# EAGLE design EPS (EAGLE 7.7.0)

## Sheet 1 of 3
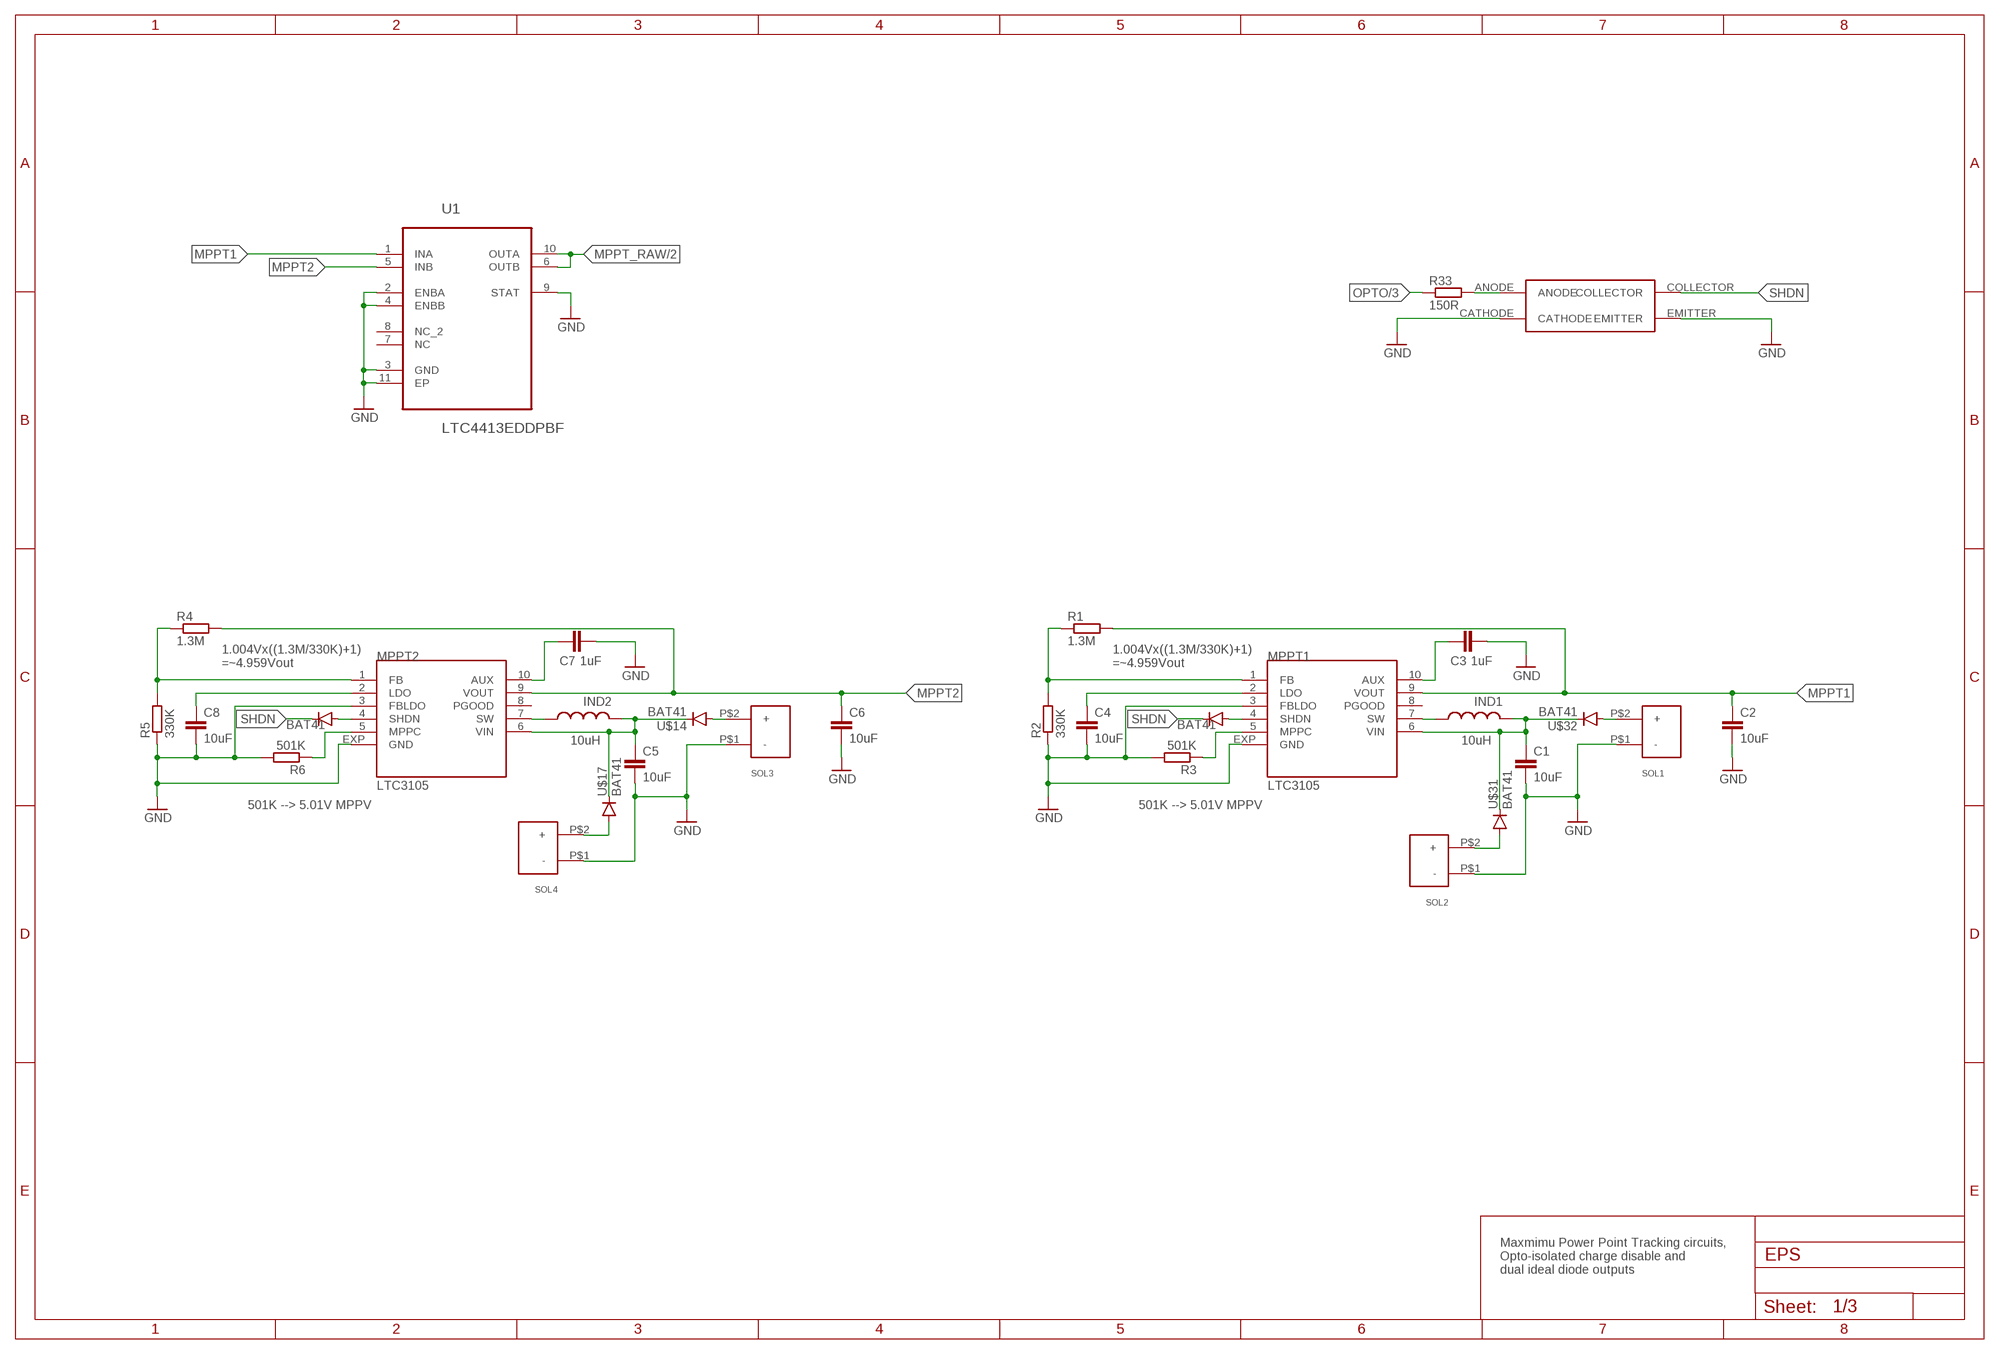
[diagram p0: schematic, sheet 1]

### Parts
C1  10uF  C-EUC0603  [C0603]
C2  10uF  C-EUC0603  [C0603]
C3  1uF  C-EUC0402  [C0402]
C4  10uF  C-EUC0603  [C0603]
C5  10uF  C-EUC0603  [C0603]
C6  10uF  C-EUC0603  [C0603]
C7  1uF  C-EUC0402  [C0402]
C8  10uF  C-EUC0603  [C0603]
IND1  WE-TPC-744031100  [WE-TPC-744031100]
IND2  WE-TPC-744031100  [WE-TPC-744031100]
MPPT1  LTC3105  [DFN-3X3]
MPPT2  LTC3105  [DFN-3X3]
R1  1.3M  R-EU_R0402  [R0402]
R2  330K  R-EU_R0402  [R0402]
R3  501K  R-EU_R0402  [R0402]
R4  1.3M  R-EU_R0402  [R0402]
R5  330K  R-EU_R0402  [R0402]
R6  501K  R-EU_R0402  [R0402]
R33  150R  R-EU_R0402  [R0402]
SOL1  JST-B2B-ZH  [JST-B2B-ZR]
SOL2  JST-B2B-ZH  [JST-B2B-ZR]
SOL3  JST-B2B-ZH  [JST-B2B-ZR]
SOL4  JST-B2B-ZH  [JST-B2B-ZR]
U1  LTC4413EDDPBF  [DFN300X300X80-11N]
U$4  BAT41  [SOD-123]
U$10  BAT41  [SOD-123]
U$14  BAT41  [SOD-123]
U$17  BAT41  [SOD-123]
U$24  EL3H7  [EL3H7]
U$31  BAT41  [SOD-123]
U$32  BAT41  [SOD-123]

### Nets
GND: C1.2 C2.2 C3.2 C4.2 C5.2 C6.2 C7.2 C8.2 MPPT1.3(FBLDO) MPPT1.EXP(GND) MPPT2.3(FBLDO) MPPT2.EXP(GND) R2.1 R3.2 R5.1 R6.2 SOL1.P$1(-) SOL2.P$1(-) SOL3.P$1(-) SOL4.P$1(-) U1.2(ENBA) U1.3(GND) U1.4(ENBB) U1.9(STAT) U1.11(EP) U$24.CATHODE U$24.EMITTER ; also sheet 2,3
MPPT1: C2.1 MPPT1.9(VOUT) R1.2 U1.1(INA)
MPPT2: C6.1 MPPT2.9(VOUT) R4.2 U1.5(INB)
MPPT_RAW: U1.6(OUTB) U1.10(OUTA) ; also sheet 2,3
N$1: IND1.P$1 MPPT1.7(SW)
N$2: C1.1 IND1.P$3 MPPT1.6(VIN) U$31.P$1(C) U$32.P$1(C)
N$3: IND2.P$1 MPPT2.7(SW)
N$4: C3.1 MPPT1.10(AUX)
N$5: C7.1 MPPT2.10(AUX)
N$6: C5.1 IND2.P$3 MPPT2.6(VIN) U$14.P$1(C) U$17.P$1(C)
N$7: MPPT2.1(FB) R4.1 R5.2
N$8: C4.1 MPPT1.2(LDO)
N$9: MPPT1.1(FB) R1.1 R2.2
N$10: MPPT2.5(MPPC) R6.1
N$11: C8.1 MPPT2.2(LDO)
N$12: MPPT2.4(SHDN) U$10.P$2(A)
N$13: SOL4.P$2(+) U$17.P$2(A)
N$14: MPPT1.4(SHDN) U$4.P$2(A)
N$15: MPPT1.5(MPPC) R3.1
N$16: SOL3.P$2(+) U$14.P$2(A)
N$17: SOL2.P$2(+) U$31.P$2(A)
N$18: SOL1.P$2(+) U$32.P$2(A)
N$33: R33.2 U$24.ANODE
OPTO: R33.1 ; also sheet 3
SHDN: U$4.P$1(C) U$10.P$1(C) U$24.COLLECTOR
Unconnected: MPPT1.8(PGOOD) MPPT2.8(PGOOD) U1.7(NC) U1.8(NC_2)

### Notes on the sheet
- 1.004Vx((1.3M/330K)+1)
  =~4.959Vout
- 1.004Vx((1.3M/330K)+1)
  =~4.959Vout
- 10uH | 10uH
- 501K --> 5.01V MPPV | 501K --> 5.01V MPPV
- Maxmimu Power Point Tracking circuits,
  Opto-isolated charge disable and
  dual ideal diode outputs

## Sheet 2 of 3
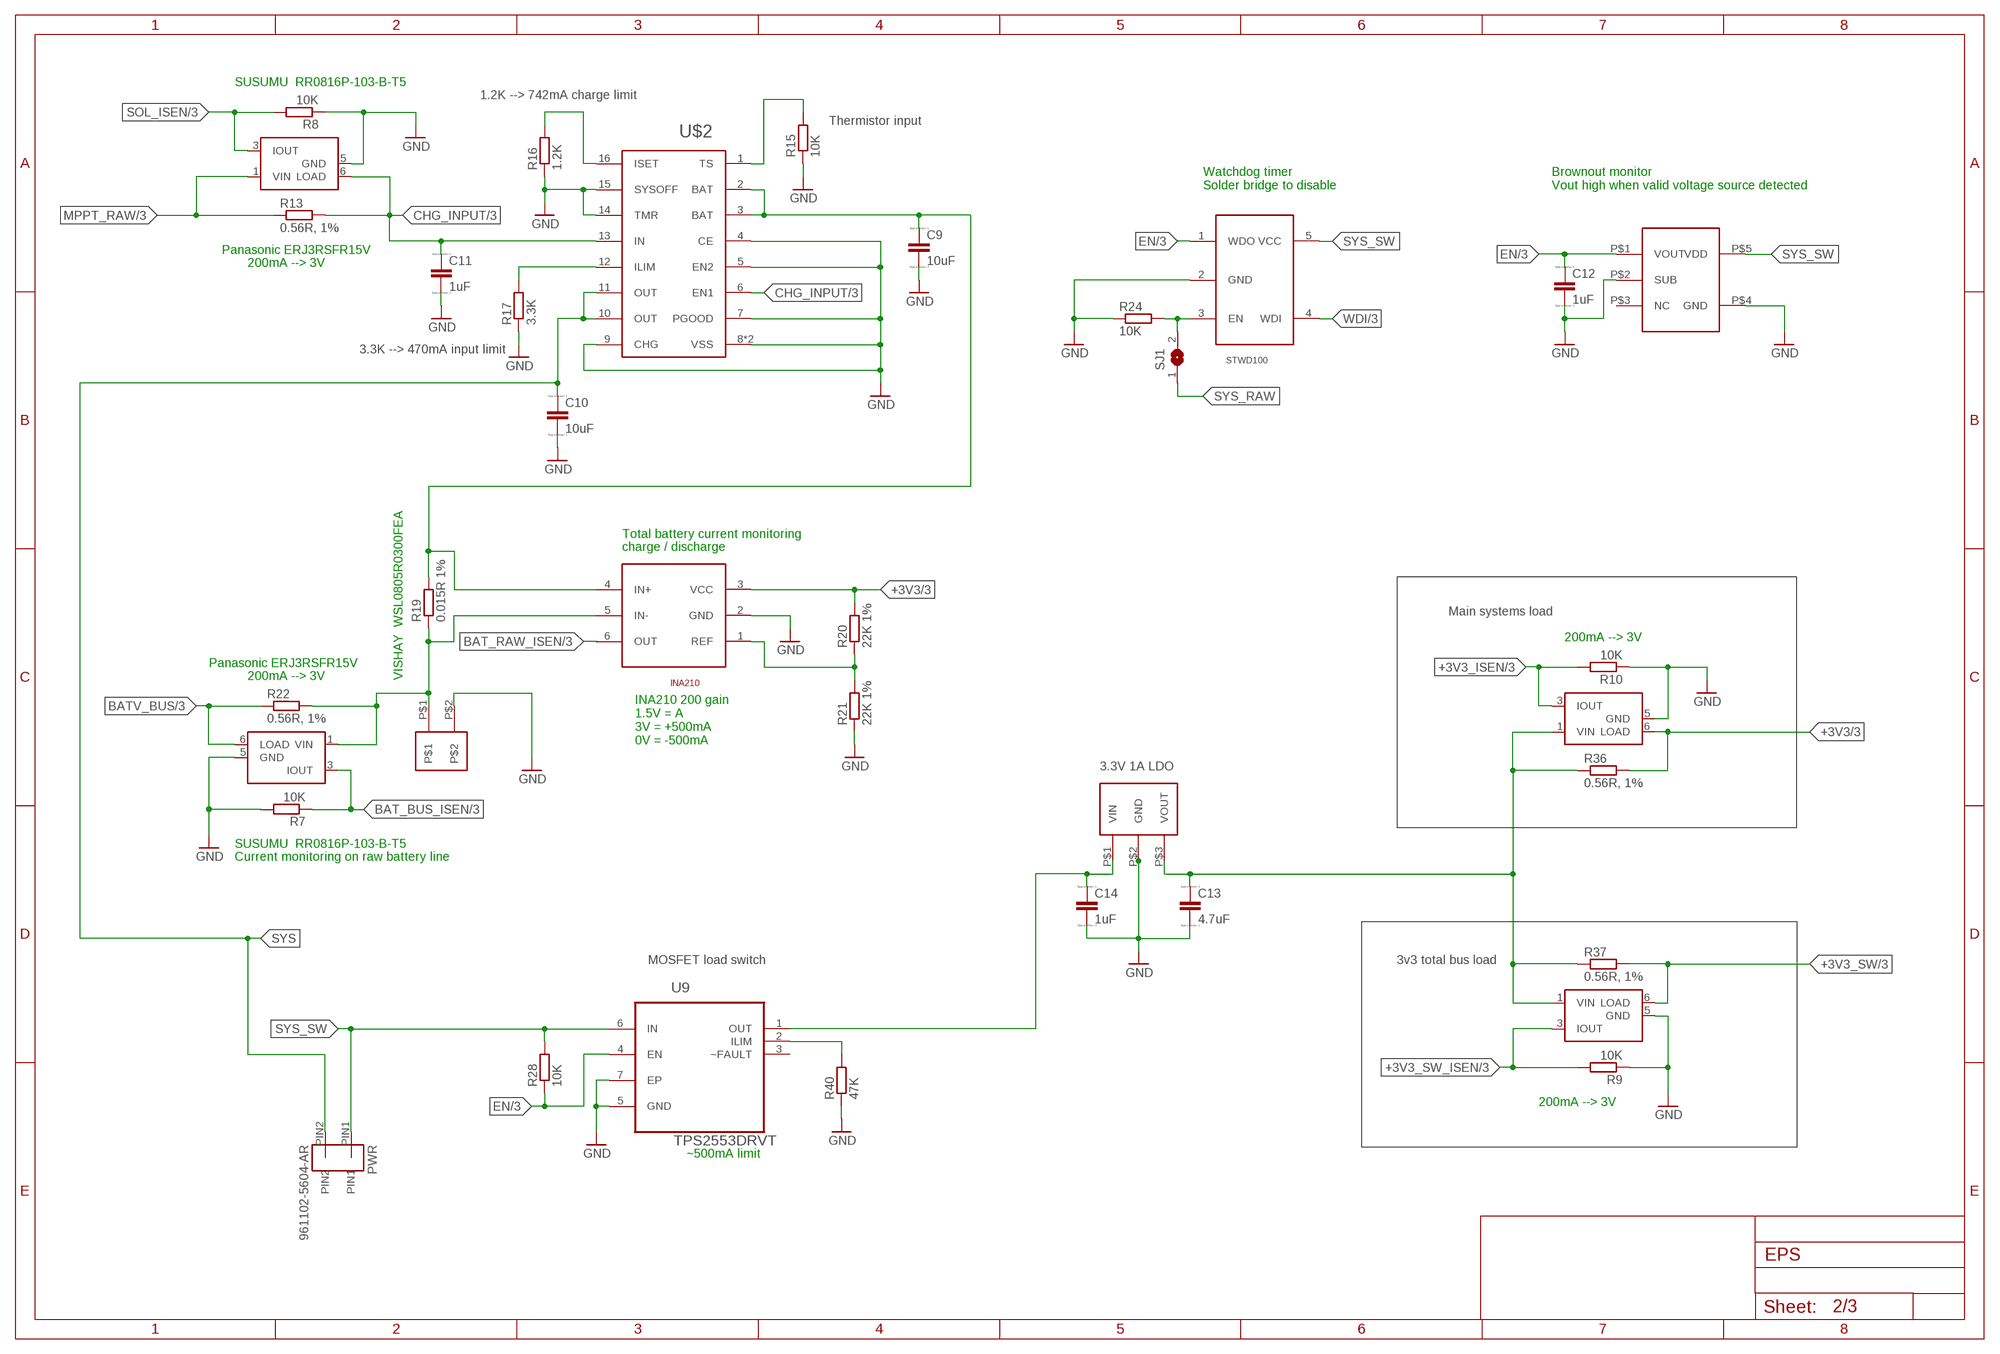
[diagram p1: schematic, sheet 2]

### Parts
C9  10uF  C-EUC0805  [C0805]
C10  10uF  C-EUC0805  [C0805]
C11  1uF  C-EUC0603  [C0603]
C12  1uF  C-EUC0603  [C0603]
C13  4.7uF  C-EUC0805  [C0805]
C14  1uF  C-EUC0603  [C0603]
INA210  INA211A  [SC-70]
PWR  961102-5604-AR  [961102-5604-AR]
R7  10K  R-EU_R0402  [R0402]
R8  10K  R-EU_R0402  [R0402]
R9  10K  R-EU_R0402  [R0402]
R10  10K  R-EU_R0402  [R0402]
R13  0.56R, 1%  R-EU_R0603  [R0603]
R15  10K  R-EU_R0402  [R0402]
R16  1.2K  R-EU_R0402  [R0402]
R17  3.3K  R-EU_R0402  [R0402]
R19  0.015R 1%  R-EU_R0603  [R0603]
R20  22K 1%  R-EU_R0402  [R0402]
R21  22K 1%  R-EU_R0402  [R0402]
R22  0.56R, 1%  R-EU_R0603  [R0603]
R24  10K  R-EU_R0402  [R0402]
R28  10K  R-EU_R0402  [R0402]
R36  0.56R, 1%  R-EU_R0603  [R0603]
R37  0.56R, 1%  R-EU_R0603  [R0603]
R40  47K  R-EU_R0402  [R0402]
SJ1  SJ  [SJ]
STWD100  STWD100PYW83F  [SOT_323-5]
U9  TPS2553DRVT  [SON65P200X200X80-7N]
U$2  BQ24079  [PVQFN16-THERM]
U$3  PICOBLADE53047  [PICOBLADE53047]
U$18  FAN4010IL6X_F113  [FAN4010IL6X_F113]
U$19  FAN4010IL6X_F113  [FAN4010IL6X_F113]
U$20  MCP1826S  [SOT223-3]
U$25  FAN4010IL6X_F113  [FAN4010IL6X_F113]
U$26  FAN4010IL6X_F113  [FAN4010IL6X_F113]
U$29  BD4835FVE  [VSOF5]

### Nets
+3V3: INA210.3(VCC) R20.2 R36.2 U$25.6(LOAD) ; also sheet 3
+3V3_ISEN: R10.2 U$25.3(IOUT) ; also sheet 3
+3V3_REG: C13.1 R36.1 R37.1 U$20.P$3(VOUT) U$25.1(VIN) U$26.1(VIN)
+3V3_SW: R37.2 U$26.6(LOAD) ; also sheet 3
+3V3_SW_ISEN: R9.2 U$26.3(IOUT) ; also sheet 3
BAT_BUS_ISEN: R7.1 U$19.3(IOUT) ; also sheet 3
BAT_RAW_ISEN: INA210.6(OUT) ; also sheet 3
BATV_BUS: R22.1 U$19.6(LOAD) ; also sheet 3
CHG_INPUT: C11.1 R13.2 U$2.6(EN1) U$2.13(IN) U$18.6(LOAD) ; also sheet 3
EN: C12.1 R28.1 STWD100.1(WDO) U9.4(EN) U$29.P$1(VOUT) ; also sheet 3
GND: C9.2 C10.2 C11.2 C12.2 C13.2 C14.2 INA210.2(GND) R7.2 R8.1 R9.1 R10.1 R15.1 R16.1 R17.1 R21.1 R24.1 R40.1 STWD100.2(GND) U9.5(GND) U9.7(EP) U$2.4(CE) U$2.5(EN2) U$2.7(PGOOD) U$2.8(VSS) U$2.9(CHG) U$2.14(TMR) U$2.15(SYSOFF) U$2.17(VSS) U$3.P$2 U$18.5(GND) U$19.5(GND) U$20.P$2(GND) U$20.P$4(GND) U$25.5(GND) U$26.5(GND) U$29.P$2(SUB) U$29.P$4(GND) ; also sheet 1,3
MPPT_RAW: R13.1 U$18.1(VIN) ; also sheet 1,3
N$20: C14.1 U9.1(OUT) U$20.P$1(VIN)
N$29: C9.1 INA210.4(IN+) R19.2 U$2.2(BAT) U$2.3(BAT)
N$30: R15.2 U$2.1(TS)
N$31: R16.2 U$2.16(ISET)
N$32: R17.2 U$2.12(ILIM)
N$37: INA210.5(IN-) R19.1 R22.2 U$3.P$1 U$19.1(VIN)
N$39: INA210.1(REF) R20.1 R21.2
N$43: R24.2 SJ1.2 STWD100.3(EN)
N$44: R40.2 U9.2(ILIM)
SOL_ISEN: R8.2 U$18.3(IOUT) ; also sheet 3
SYS: C10.1 PWR.PIN2 U$2.10(OUT) U$2.11(OUT)
SYS_RAW: SJ1.1
SYS_SW: PWR.PIN1 R28.2 STWD100.5(VCC) U9.6(IN) U$29.P$5(VDD)
WDI: STWD100.4(WDI) ; also sheet 3
Unconnected: U9.3(~FAULT) U$18.2(NC) U$18.4(NC) U$19.2(NC) U$19.4(NC) U$25.2(NC) U$25.4(NC) U$26.2(NC) U$26.4(NC) U$29.P$3(NC)

### Notes on the sheet
- SUSUMU  RR0816P-103-B-T5
- 1.2K --> 742mA charge limit
- Thermistor input
- Watchdog timer
  Solder bridge to disable
- Brownout monitor
  Vout high when valid voltage source detected
- Panasonic ERJ3RSFR15V
- 200mA --> 3V
- 3.3K --> 470mA input limit
- Total battery current monitoring
- charge / discharge
- Main systems load
- 200mA --> 3V
- Panasonic ERJ3RSFR15V
- 200mA --> 3V | VISHAY  WSL0805R0300FEA
- INA210 200 gain
  1.5V = A
  3V = +500mA
  0V = -500mA
- 3.3V 1A LDO
- SUSUMU  RR0816P-103-B-T5
- Current monitoring on raw battery line
- MOSFET load switch | 3v3 total bus load
- 200mA --> 3V
- ~500mA limit

## Sheet 3 of 3
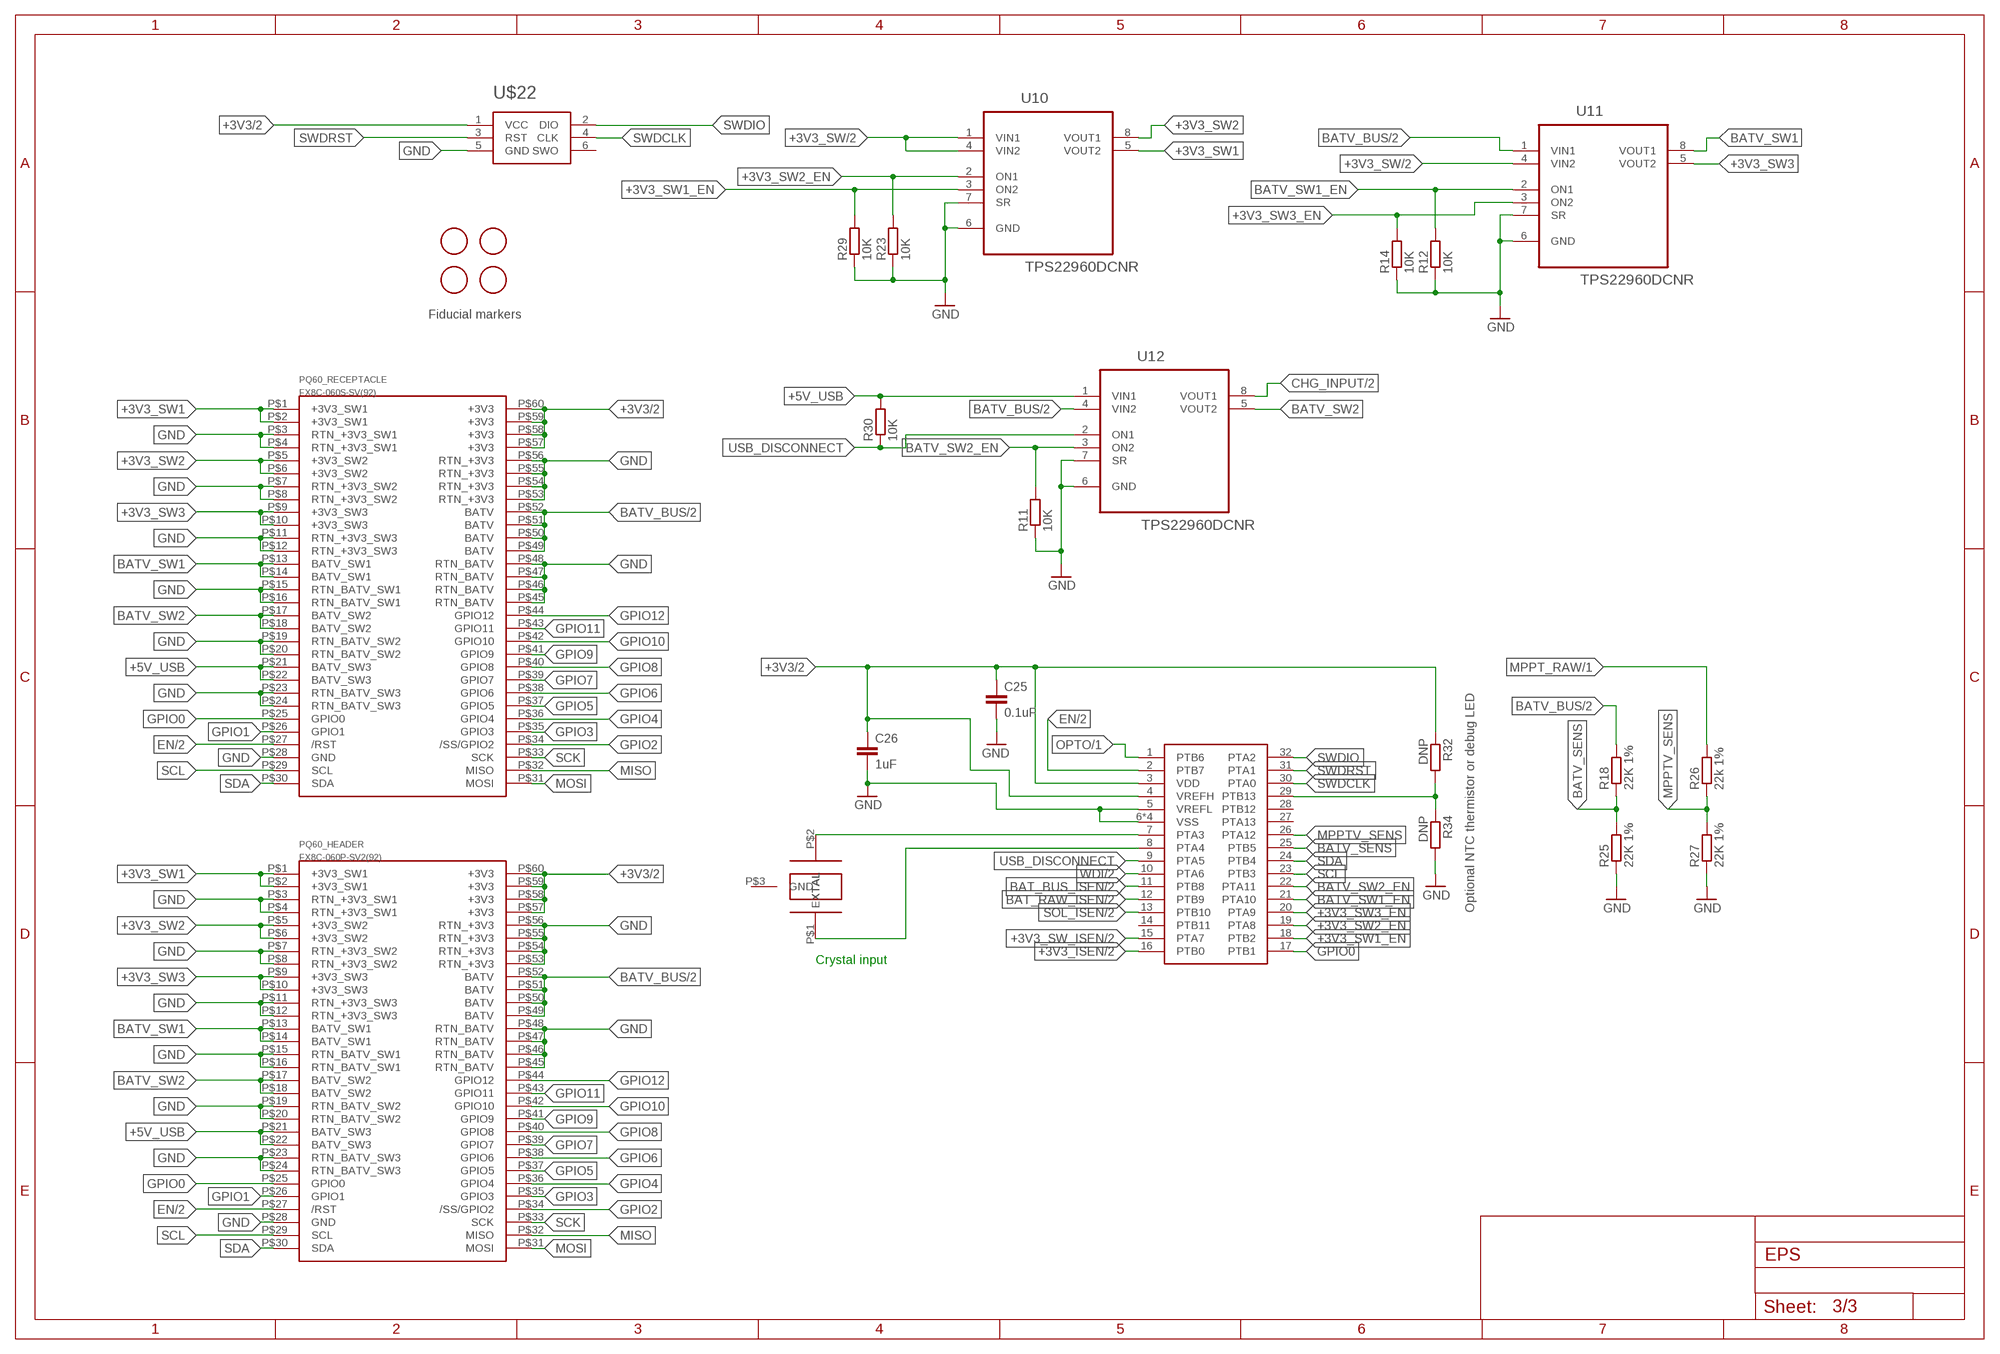
[diagram p2: schematic, sheet 3]

### Parts
C25  0.1uF  C-EUC0402  [C0402]
C26  1uF  C-EUC0402  [C0402]
FD1  FIDUCIAL  [FIDUCIAL_1MM]
FD2  FIDUCIAL  [FIDUCIAL_1MM]
FD3  FIDUCIAL  [FIDUCIAL_1MM]
FD4  FIDUCIAL  [FIDUCIAL_1MM]
PQ60_HEADER  FX8C-060P-SV2(92)  [FX8C-060P-SV(92)]
PQ60_RECEPTACLE  FX8C-060S-SV(92)  [FX8C-060S-SV(92)]
R11  10K  R-EU_R0402  [R0402]
R12  10K  R-EU_R0402  [R0402]
R14  10K  R-EU_R0402  [R0402]
R18  22K 1%  R-EU_R0402  [R0402]
R23  10K  R-EU_R0402  [R0402]
R25  22K 1%  R-EU_R0402  [R0402]
R26  22k 1%  R-EU_R0402  [R0402]
R27  22K 1%  R-EU_R0402  [R0402]
R29  10K  R-EU_R0402  [R0402]
R30  10K  R-EU_R0402  [R0402]
R32  DNP  R-EU_R0402  [R0402]
R34  DNP  R-EU_R0402  [R0402]
U10  TPS22960DCNR  [SOT65P280X145-8N]
U11  TPS22960DCNR  [SOT65P280X145-8N]
U12  TPS22960DCNR  [SOT65P280X145-8N]
U$1  AB26TRQ  [AB26TRQ]
U$21  MKL02Z16VFM4  [MKL02Z16VFM4]
U$22  TAG_CONNECT_NO_HOLES  [TAG_CONNECT_NO_HOLES]

### Nets
+3V3: C25.1 C26.1 PQ60_HEADER.P$57(+3V3) PQ60_HEADER.P$58(+3V3) PQ60_HEADER.P$59(+3V3) PQ60_HEADER.P$60(+3V3) PQ60_RECEPTACLE.P$57(+3V3) PQ60_RECEPTACLE.P$58(+3V3) PQ60_RECEPTACLE.P$59(+3V3) PQ60_RECEPTACLE.P$60(+3V3) R32.1 U$21.3(VDD) U$21.4(VREFH) U$22.1(VCC) ; also sheet 2
+3V3_ISEN: U$21.16(PTB0) ; also sheet 2
+3V3_SW: U10.1(VIN1) U10.4(VIN2) U11.4(VIN2) ; also sheet 2
+3V3_SW1: PQ60_HEADER.P$1(+3V3_SW1) PQ60_HEADER.P$2(+3V3_SW1) PQ60_RECEPTACLE.P$1(+3V3_SW1) PQ60_RECEPTACLE.P$2(+3V3_SW1) U10.5(VOUT2)
+3V3_SW1_EN: R29.2 U10.3(ON2) U$21.18(PTB2)
+3V3_SW2: PQ60_HEADER.P$5(+3V3_SW2) PQ60_HEADER.P$6(+3V3_SW2) PQ60_RECEPTACLE.P$5(+3V3_SW2) PQ60_RECEPTACLE.P$6(+3V3_SW2) U10.8(VOUT1)
+3V3_SW2_EN: R23.2 U10.2(ON1) U$21.19(PTA8)
+3V3_SW3: PQ60_HEADER.P$9(+3V3_SW3) PQ60_HEADER.P$10(+3V3_SW3) PQ60_RECEPTACLE.P$9(+3V3_SW3) PQ60_RECEPTACLE.P$10(+3V3_SW3) U11.5(VOUT2)
+3V3_SW3_EN: R14.2 U11.3(ON2) U$21.20(PTA9)
+3V3_SW_ISEN: U$21.15(PTA7) ; also sheet 2
+5V_USB: PQ60_HEADER.P$21(BATV_SW3) PQ60_HEADER.P$22(BATV_SW3) PQ60_RECEPTACLE.P$21(BATV_SW3) PQ60_RECEPTACLE.P$22(BATV_SW3) R30.2 U12.1(VIN1)
BAT_BUS_ISEN: U$21.11(PTB8) ; also sheet 2
BAT_RAW_ISEN: U$21.12(PTB9) ; also sheet 2
BATV_BUS: PQ60_HEADER.P$49(BATV) PQ60_HEADER.P$50(BATV) PQ60_HEADER.P$51(BATV) PQ60_HEADER.P$52(BATV) PQ60_RECEPTACLE.P$49(BATV) PQ60_RECEPTACLE.P$50(BATV) PQ60_RECEPTACLE.P$51(BATV) PQ60_RECEPTACLE.P$52(BATV) R18.2 U11.1(VIN1) U12.4(VIN2) ; also sheet 2
BATV_SENS: R18.1 R25.2 U$21.25(PTB5)
BATV_SW1: PQ60_HEADER.P$13(BATV_SW1) PQ60_HEADER.P$14(BATV_SW1) PQ60_RECEPTACLE.P$13(BATV_SW1) PQ60_RECEPTACLE.P$14(BATV_SW1) U11.8(VOUT1)
BATV_SW1_EN: R12.2 U11.2(ON1) U$21.21(PTA10)
BATV_SW2: PQ60_HEADER.P$17(BATV_SW2) PQ60_HEADER.P$18(BATV_SW2) PQ60_RECEPTACLE.P$17(BATV_SW2) PQ60_RECEPTACLE.P$18(BATV_SW2) U12.5(VOUT2)
BATV_SW2_EN: R11.2 U12.3(ON2) U$21.22(PTA11)
CHG_INPUT: U12.8(VOUT1) ; also sheet 2
EN: PQ60_HEADER.P$27(/RST) PQ60_RECEPTACLE.P$27(/RST) U$21.2(PTB7) ; also sheet 2
GND: C25.2 C26.2 PQ60_HEADER.P$3(RTN_+3V3_SW1) PQ60_HEADER.P$4(RTN_+3V3_SW1) PQ60_HEADER.P$7(RTN_+3V3_SW2) PQ60_HEADER.P$8(RTN_+3V3_SW2) PQ60_HEADER.P$11(RTN_+3V3_SW3) PQ60_HEADER.P$12(RTN_+3V3_SW3) PQ60_HEADER.P$15(RTN_BATV_SW1) PQ60_HEADER.P$16(RTN_BATV_SW1) PQ60_HEADER.P$19(RTN_BATV_SW2) PQ60_HEADER.P$20(RTN_BATV_SW2) PQ60_HEADER.P$23(RTN_BATV_SW3) PQ60_HEADER.P$24(RTN_BATV_SW3) PQ60_HEADER.P$28(GND) PQ60_HEADER.P$45(RTN_BATV) PQ60_HEADER.P$46(RTN_BATV) PQ60_HEADER.P$47(RTN_BATV) PQ60_HEADER.P$48(RTN_BATV) PQ60_HEADER.P$53(RTN_+3V3) PQ60_HEADER.P$54(RTN_+3V3) PQ60_HEADER.P$55(RTN_+3V3) PQ60_HEADER.P$56(RTN_+3V3) PQ60_RECEPTACLE.P$3(RTN_+3V3_SW1) PQ60_RECEPTACLE.P$4(RTN_+3V3_SW1) PQ60_RECEPTACLE.P$7(RTN_+3V3_SW2) PQ60_RECEPTACLE.P$8(RTN_+3V3_SW2) PQ60_RECEPTACLE.P$11(RTN_+3V3_SW3) PQ60_RECEPTACLE.P$12(RTN_+3V3_SW3) PQ60_RECEPTACLE.P$15(RTN_BATV_SW1) PQ60_RECEPTACLE.P$16(RTN_BATV_SW1) PQ60_RECEPTACLE.P$19(RTN_BATV_SW2) PQ60_RECEPTACLE.P$20(RTN_BATV_SW2) PQ60_RECEPTACLE.P$23(RTN_BATV_SW3) PQ60_RECEPTACLE.P$24(RTN_BATV_SW3) PQ60_RECEPTACLE.P$28(GND) PQ60_RECEPTACLE.P$45(RTN_BATV) PQ60_RECEPTACLE.P$46(RTN_BATV) PQ60_RECEPTACLE.P$47(RTN_BATV) PQ60_RECEPTACLE.P$48(RTN_BATV) PQ60_RECEPTACLE.P$53(RTN_+3V3) PQ60_RECEPTACLE.P$54(RTN_+3V3) PQ60_RECEPTACLE.P$55(RTN_+3V3) PQ60_RECEPTACLE.P$56(RTN_+3V3) R11.1 R12.1 R14.1 R23.1 R25.1 R27.1 R29.1 R34.2 U10.6(GND) U10.7(SR) U11.6(GND) U11.7(SR) U12.6(GND) U12.7(SR) U$21.5(VREFL) U$21.6(VSS) U$21.GND@1(VSS) U$21.GND@2(VSS) U$21.GND@3(VSS) U$22.5(GND) ; also sheet 1,2
GPIO0: PQ60_HEADER.P$25(GPIO0) PQ60_RECEPTACLE.P$25(GPIO0) U$21.17(PTB1)
GPIO1: PQ60_HEADER.P$26(GPIO1) PQ60_RECEPTACLE.P$26(GPIO1)
GPIO2: PQ60_HEADER.P$34(/SS/GPIO2) PQ60_RECEPTACLE.P$34(/SS/GPIO2)
GPIO3: PQ60_HEADER.P$35(GPIO3) PQ60_RECEPTACLE.P$35(GPIO3)
GPIO4: PQ60_HEADER.P$36(GPIO4) PQ60_RECEPTACLE.P$36(GPIO4)
GPIO5: PQ60_HEADER.P$37(GPIO5) PQ60_RECEPTACLE.P$37(GPIO5)
GPIO6: PQ60_HEADER.P$38(GPIO6) PQ60_RECEPTACLE.P$38(GPIO6)
GPIO7: PQ60_HEADER.P$39(GPIO7) PQ60_RECEPTACLE.P$39(GPIO7)
GPIO8: PQ60_HEADER.P$40(GPIO8) PQ60_RECEPTACLE.P$40(GPIO8)
GPIO9: PQ60_HEADER.P$41(GPIO9) PQ60_RECEPTACLE.P$41(GPIO9)
GPIO10: PQ60_HEADER.P$42(GPIO10) PQ60_RECEPTACLE.P$42(GPIO10)
GPIO11: PQ60_HEADER.P$43(GPIO11) PQ60_RECEPTACLE.P$43(GPIO11)
GPIO12: PQ60_HEADER.P$44(GPIO12) PQ60_RECEPTACLE.P$44(GPIO12)
MISO: PQ60_HEADER.P$32(MISO) PQ60_RECEPTACLE.P$32(MISO)
MOSI: PQ60_HEADER.P$31(MOSI) PQ60_RECEPTACLE.P$31(MOSI)
MPPT_RAW: R26.2 ; also sheet 1,2
MPPTV_SENS: R26.1 R27.2 U$21.26(PTA12)
N$19: U$1.P$2(EXTAL) U$21.7(PTA3)
N$21: R32.2 R34.1 U$21.29(PTB13)
N$22: U$1.P$1(XTAL) U$21.8(PTA4)
OPTO: U$21.1(PTB6) ; also sheet 1
SCK: PQ60_HEADER.P$33(SCK) PQ60_RECEPTACLE.P$33(SCK)
SCL: PQ60_HEADER.P$29(SCL) PQ60_RECEPTACLE.P$29(SCL) U$21.23(PTB3)
SDA: PQ60_HEADER.P$30(SDA) PQ60_RECEPTACLE.P$30(SDA) U$21.24(PTB4)
SOL_ISEN: U$21.13(PTB10) ; also sheet 2
SWDCLK: U$21.30(PTA0) U$22.4(CLK)
SWDIO: U$21.32(PTA2) U$22.2(DIO)
SWDRST: U$21.31(PTA1) U$22.3(RST)
USB_DISCONNECT: R30.1 U12.2(ON1) U$21.9(PTA5)
WDI: U$21.10(PTA6) ; also sheet 2
Unconnected: U$1.P$3(GND) U$21.14(PTB11) U$21.27(PTA13) U$21.28(PTB12) U$22.6(SWO)

### Notes on the sheet
- Fiducial markers
- Optional NTC thermistor or debug LED
- Crystal input

## Library data of the parts
C1-C8 C25 C26 = resistor:C-EU: CAPACITOR, European symbol
C9-C14 = EPS_PQ60:C-EU: CAPACITOR, European symbol; SPICEPREFIX: C
FD1-FD4 = adafruit:FIDUCIAL: For use by pick and place machines to calibrate the vision/machine, 1mm By microbuilder.eu
INA210 = ubo_PQ60:INA211A
IND1 IND2 = ubo_PQ60:WE-TPC-744031100
MPPT1 MPPT2 = ubo_PQ60:LTC3105
PQ60_HEADER = OBC:FX8C-060P-SV2(92)
PQ60_RECEPTACLE = Template:FX8C-060S-SV(92)
PWR = ubo_PQ60:961102-5604-AR
R1-R30 R32-R34 R36 R37 R40 = resistor:R-EU_: RESISTOR, European symbol
SJ1 = ubo_PQ60:SJ: SMD solder JUMPER
SOL1-SOL4 = ubo_PQ60:JST-B2B-ZH
STWD100 = ubo_PQ60:STWD100PYW83F
U1 = ubo_PQ60:LTC4413EDDPBF: Dual 2.6A, 2.5V to 5.5V, Ideal Diodes; MPN: LTC4413EDD#PBF; OC_FARNELL: 1663736; OC_NEWARK: 56M9529; PACKAGE: DFN-10; SUPPLIER: Linear Technology
U9 = ubo_PQ60:TPS2553DRVT: POWER-DISTRIBUTION SWITCHES; MPN: TPS2553DRVT; OC_FARNELL: 1694427; OC_NEWARK: 40P3872; PACKAGE: SON-6; SUPPLIER: TEXAS INSTRUMENTS
U10-U12 = ubo_PQ60:TPS22960DCNR: LOW INPUT VOLTAGE, DUAL LOAD SWITCH WITH CONTROLLED TURN-ON; MPN: TPS22960DCNR; OC_FARNELL: 1735581; OC_NEWARK: 10R1440; PACKAGE: SOT-23-8; SUPPLIER: TEXAS INSTRUMENTS
U$1 = EPS_PQ60:AB26TRQ
U$2 = ubo_PQ60:BQ24079
U$3 = ubo_PQ60:PICOBLADE53047
U$4 U$10 U$14 U$17 U$31 U$32 = ubo_PQ60:BAT41
U$18 U$19 U$25 U$26 = ubo_PQ60:FAN4010IL6X_F113
U$20 = EPS_PQ60:MCP1826S
U$21 = OBC:MKL02Z16VFM4
U$22 = ubo_PQ60:TAG_CONNECT_NO_HOLES
U$24 = ubo_PQ60:EL3H7
U$29 = EPS_PQ60:BD4835FVE

## Board
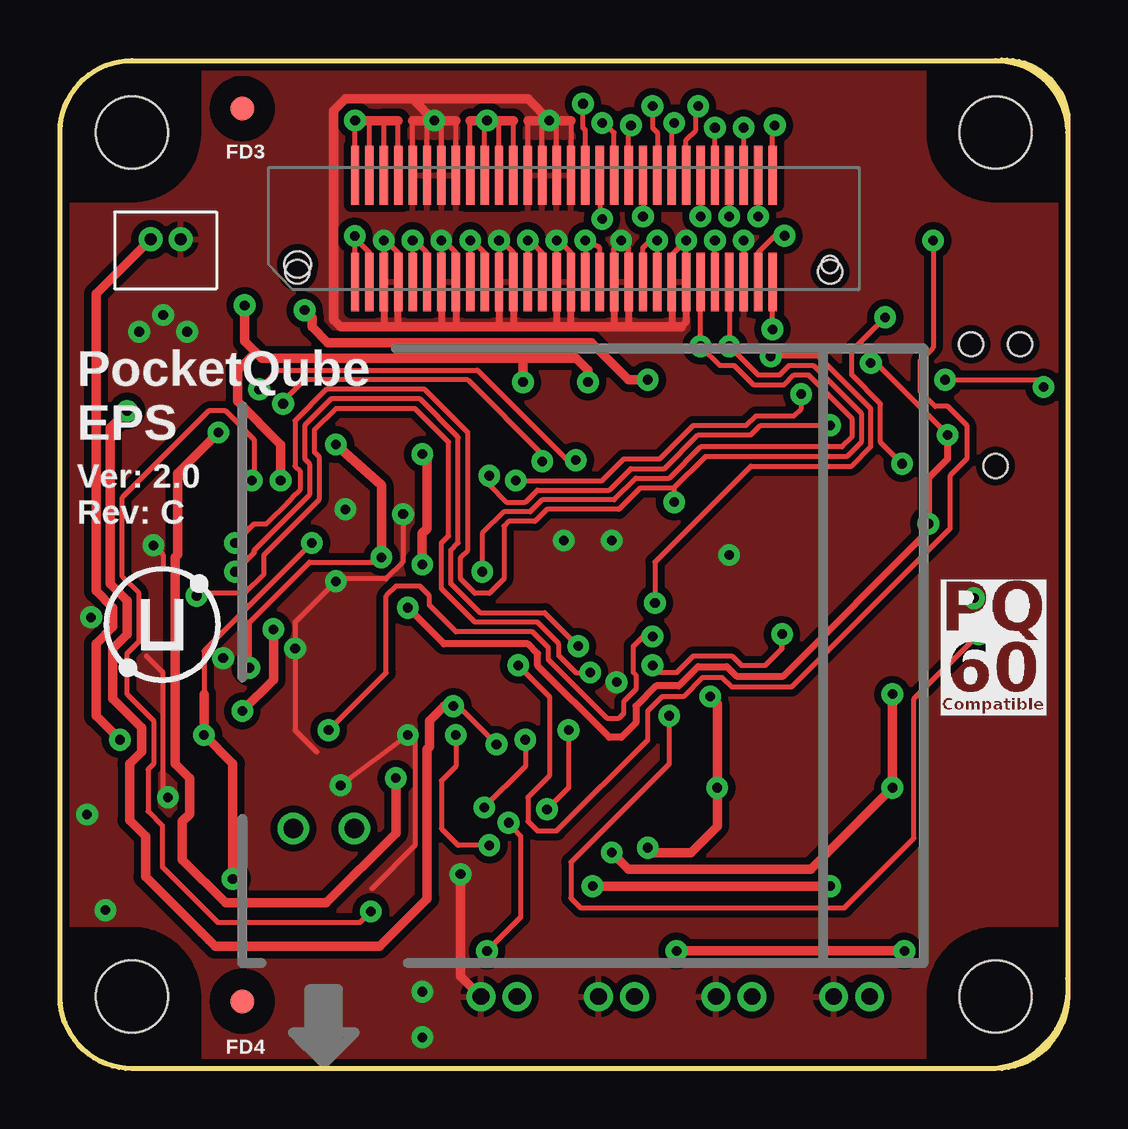
[diagram p3: board, top side]
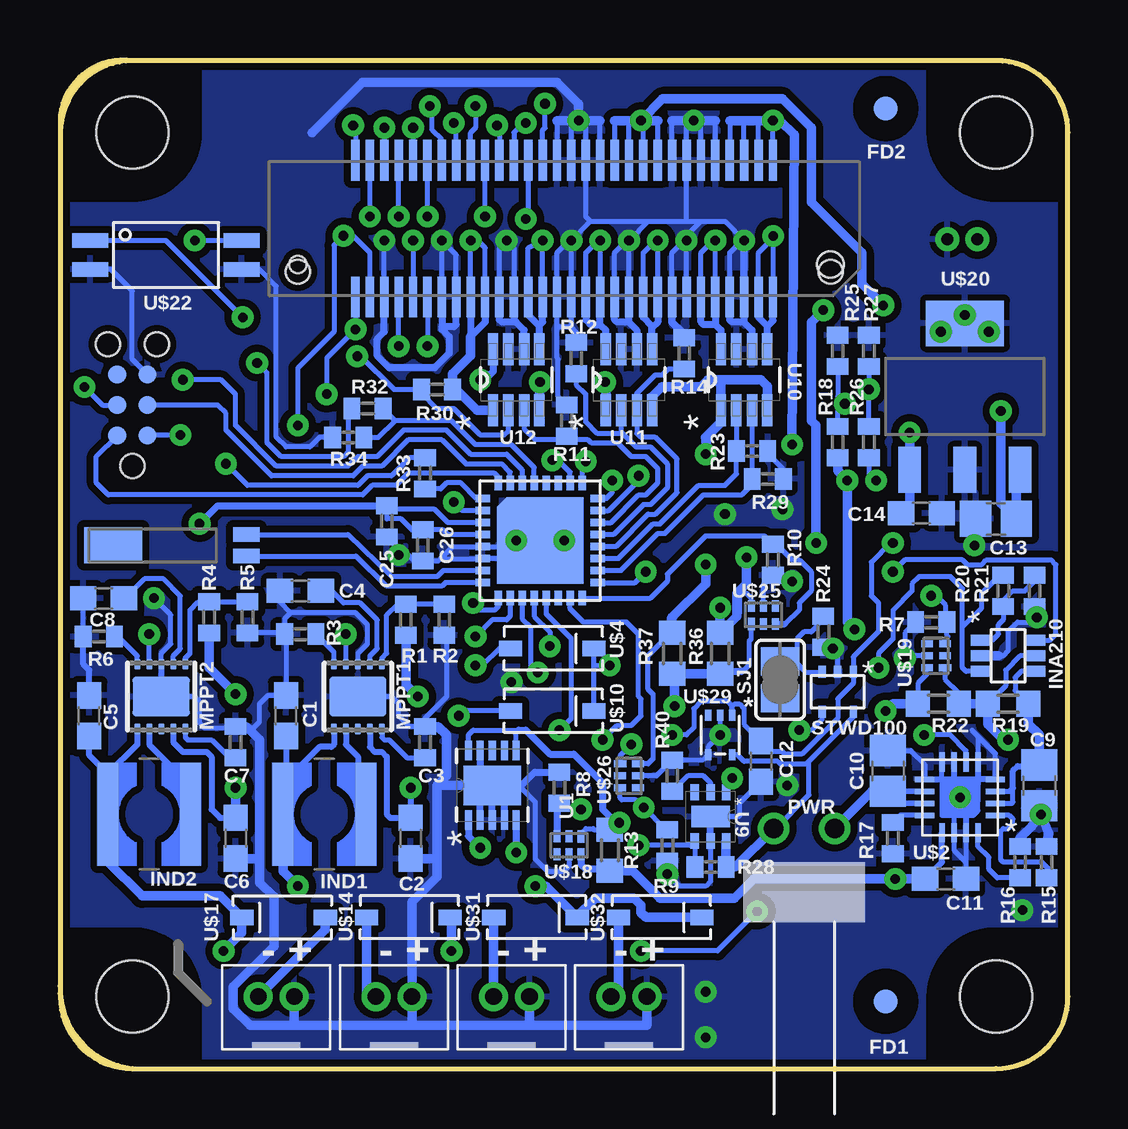
[diagram p4: board, bottom side, seen from below]

Size 42.02 x 42.02 mm. Coordinates in mm from the lower left corner, seen from the top.
Outline: 0,39 arc-90 3,42 39,42 arc-90 42,39.75 42,3.75 arc-90 39,0 3,0 arc-90 0,3 0,39
Copper layers (1*16): Top 0.035mm / dielectric 1.5mm / Bottom 0.035mm
Design rules "pcbtrain *": minimum track width 0.2mm, minimum drill 0.4mm, track to track 0.2mm, track to pad 0.2mm, pad to pad 0.2mm, via to via 0.2mm, smd to smd 0mil, copper to edge 10mil, drill to drill 0.2mm, minimum pad ring 10mil, minimum via ring 10mil, stop-mask expansion 0.125mm, vias tented up to drill 0.5mm, thermal gap 10mil
Holes 3 mm at 3,3 39,3 39,39 3,39
tKeepout: area 0,0 to 6,6; area 36,0 to 42,6; area 36,36 to 42,42; area 0,36 to 6,42; 8 lines
Milling: 8 lines

### Footprints (pad centres in the part's own frame; a part is rotated, then mirrored left to right if it is on the bottom)
C0603 = smd 1.1 x 1: 1 -0.85,0; 2 0.85,0
C0402 = smd 0.7 x 0.9: 1 -0.65,0; 2 0.65,0
C0805 = smd 1.3 x 1.5: 1 -0.85,0; 2 0.85,0
FIDUCIAL_1MM = smd 1 x 1: 1 0,0
SC-70 = smd 0.45 x 0.9: 1 -0.65,-1.1; 2 0,-1.1; 3 0.65,-1.1; 4 0.65,1.1; 5 0,1.1; 6 -0.65,1.1
WE-TPC-744031100 = smd 4.3 x 0.85: P$1 0,-1.725; P$3 0,1.725
DFN-3X3 = smd 0.25 x 0.45: 1 -1,-1.35; 2 -0.5,-1.35; 3 0,-1.35; 4 0.5,-1.35; 5 1,-1.35; 6 1,1.35; 7 0.5,1.35; 8 0,1.35; 9 -0.5,1.35; 10 -1,1.35 | smd 2.38 x 1.65: EXP 0,0
FX8C-060P-SV(92) = smd 0.35 x 2.45: P$1 -8.7,-2.225; P$2 -8.1,-2.225; P$3 -7.5,-2.225; P$4 -6.9,-2.225; P$5 -6.3,-2.225; P$6 -5.7,-2.225; P$7 -5.1,-2.225; P$8 -4.5,-2.225; P$9 -3.9,-2.225; P$10 -3.3,-2.225; P$11 -2.7,-2.225; P$12 -2.1,-2.225; P$13 -1.5,-2.225; P$14 -0.9,-2.225; P$15 -0.3,-2.225; P$16 0.3,-2.225; P$17 0.9,-2.225; P$18 1.5,-2.225; P$19 2.1,-2.225; P$20 2.7,-2.225; P$21 3.3,-2.225; P$22 3.9,-2.225; P$23 4.5,-2.225; P$24 5.1,-2.225; P$25 5.7,-2.225; P$26 6.3,-2.225; P$27 6.9,-2.225; P$28 7.5,-2.225; P$29 8.1,-2.225; P$30 8.7,-2.225; P$31 8.7,2.225; P$32 8.1,2.225; P$33 7.5,2.225; P$34 6.9,2.225; P$35 6.3,2.225; P$36 5.7,2.225; P$37 5.1,2.225; P$38 4.5,2.225; P$39 3.9,2.225; P$40 3.3,2.225; P$41 2.7,2.225; P$42 2.1,2.225; P$43 1.5,2.225; P$44 0.9,2.225; P$45 0.3,2.225; P$46 -0.3,2.225; P$47 -0.9,2.225; P$48 -1.5,2.225; P$49 -2.1,2.225; P$50 -2.7,2.225; P$51 -3.3,2.225; P$52 -3.9,2.225; P$53 -4.5,2.225; P$54 -5.1,2.225; P$55 -5.7,2.225; P$56 -6.3,2.225; P$57 -6.9,2.225; P$58 -7.5,2.225; P$59 -8.1,2.225; P$60 -8.7,2.225 | hole 1.1: -11.1,-1.499 | hole 0.7: 11.1,-1.499
FX8C-060S-SV(92) = smd 0.35 x 1.7: P$1 -8.7,2.85; P$2 -8.1,2.85; P$3 -7.5,2.85; P$4 -6.9,2.85; P$5 -6.3,2.85; P$6 -5.7,2.85; P$7 -5.1,2.85; P$8 -4.5,2.85; P$9 -3.9,2.85; P$10 -3.3,2.85; P$11 -2.7,2.85; P$12 -2.1,2.85; P$13 -1.5,2.85; P$14 -0.9,2.85; P$15 -0.3,2.85; P$16 0.3,2.85; P$17 0.9,2.85; P$18 1.5,2.85; P$19 2.1,2.85; P$20 2.7,2.85; P$21 3.3,2.85; P$22 3.9,2.85; P$23 4.5,2.85; P$24 5.1,2.85; P$25 5.7,2.85; P$26 6.3,2.85; P$27 6.9,2.85; P$28 7.5,2.85; P$29 8.1,2.85; P$30 8.7,2.85; P$31 8.7,-2.85; P$32 8.1,-2.85; P$33 7.5,-2.85; P$34 6.9,-2.85; P$35 6.3,-2.85; P$36 5.7,-2.85; P$37 5.1,-2.85; P$38 4.5,-2.85; P$39 3.9,-2.85; P$40 3.3,-2.85; P$41 2.7,-2.85; P$42 2.1,-2.85; P$43 1.5,-2.85; P$44 0.9,-2.85; P$45 0.3,-2.85; P$46 -0.3,-2.85; P$47 -0.9,-2.85; P$48 -1.5,-2.85; P$49 -2.1,-2.85; P$50 -2.7,-2.85; P$51 -3.3,-2.85; P$52 -3.9,-2.85; P$53 -4.5,-2.85; P$54 -5.1,-2.85; P$55 -5.7,-2.85; P$56 -6.3,-2.85; P$57 -6.9,-2.85; P$58 -7.5,-2.85; P$59 -8.1,-2.85; P$60 -8.7,-2.85 | hole 1: -11.1,1.8; 11.1,1.8
961102-5604-AR = drill 0.8: PIN1 -1.27,0; PIN2 1.27,0
R0402 = smd 0.7 x 0.9: 1 -0.65,0; 2 0.65,0
R0603 = smd 1 x 1.1: 1 -0.85,0; 2 0.85,0
SJ = smd 1.168 x 1.6: 1 -0.762,0; 2 0.762,0
JST-B2B-ZR = drill 0.7 pad 1.1: P$1 -0.75,0; P$2 0.75,0
SOT_323-5 = smd 0.3 x 0.5: 1 0.65,0.825; 2 0,0.825; 3 -0.65,0.825; 4 -0.65,-0.825; 5 0.65,-0.825
DFN300X300X80-11N = smd 0.813 x 0.305: 1 -1.448,0.991; 2 -1.448,0.508; 3 -1.448,0; 4 -1.448,-0.508; 5 -1.448,-0.991; 6 1.448,-0.991; 7 1.448,-0.508; 8 1.448,0; 9 1.448,0.508; 10 1.448,0.991 | smd 1.651 x 2.388: 11 0,0
SON65P200X200X80-7N = smd 0.66 x 0.356: 1 -1.016,0.66; 2 -1.016,0; 3 -1.016,-0.66; 4 1.016,-0.66; 5 1.016,0; 6 1.016,0.66 | smd 0.889 x 1.6: 7 0,0
SOT65P280X145-8N = smd 1.321 x 0.432: 1 -1.27,0.965; 2 -1.27,0.33; 3 -1.27,-0.33; 4 -1.27,-0.965; 5 1.27,-0.965; 6 1.27,-0.33; 7 1.27,0.33; 8 1.27,0.965
AB26TRQ = smd 1.1 x 0.6: P$1 2.45,-0.45; P$2 2.45,0.45 | smd 2.4 x 1.5: P$3 -3.1,0
PVQFN16-THERM = smd 0.8 x 0.23: 1 -1.475,0.75; 2 -1.475,0.25; 3 -1.475,-0.25; 4 -1.475,-0.75; 9 1.475,-0.75; 10 1.475,-0.25; 11 1.475,0.25; 12 1.475,0.75 | smd 0.23 x 0.8: 5 -0.75,-1.475; 6 -0.25,-1.475; 7 0.25,-1.475; 8 0.75,-1.475; 13 0.75,1.475; 14 0.25,1.475; 15 -0.25,1.475; 16 -0.75,1.475 | smd 0.25 x 0.25: 17 0,0
PICOBLADE53047 = drill 0.5: P$1 -0.625,0.45; P$2 0.625,0.45
SOD-123 = smd 0.97 x 0.65: P$1 -1.74,0; P$2 1.74,0
FAN4010IL6X_F113 = smd 0.3 x 0.52: 1 -0.5,-0.375 | smd 0.3 x 0.49: 2 0,-0.375; 3 0.5,-0.375; 4 0.5,0.375; 5 0,0.375; 6 -0.5,0.375
SOT223-3 = smd 0.95 x 1.9: P$1 -2.3,-3.05; P$2 0,-3.05; P$3 2.3,-3.05 | smd 3.25 x 1.9: P$4 0,3.05
MKL02Z16VFM4 = smd 0.3 x 0.6: 1 -1.75,-2.4; 2 -1.25,-2.4; 3 -0.75,-2.4; 4 -0.25,-2.4; 5 0.25,-2.4; 6 0.75,-2.4; 7 1.25,-2.4; 8 1.75,-2.4; 17 1.75,2.4; 18 1.25,2.4; 19 0.75,2.4; 20 0.25,2.4; 21 -0.25,2.4; 22 -0.75,2.4; 23 -1.25,2.4; 24 -1.75,2.4 | smd 0.6 x 0.3: 9 2.4,-1.75; 10 2.4,-1.25; 11 2.4,-0.75; 12 2.4,-0.25; 13 2.4,0.25; 14 2.4,0.75; 15 2.4,1.25; 16 2.4,1.75; 25 -2.4,1.75; 26 -2.4,1.25; 27 -2.4,0.75; 28 -2.4,0.25; 29 -2.4,-0.25; 30 -2.4,-0.75; 31 -2.4,-1.25; 32 -2.4,-1.75 | smd 3.6 x 3.2: GND@1 0,0.2 | smd 0.566 x 1 rotated 315: GND@2 -1.246,-1.246 | smd 3.2 x 0.4: GND@3 0.2,-1.6
TAG_CONNECT_NO_HOLES = smd 0.75 x 0.75: 1 1.27,-0.635; 2 1.27,0.635; 3 2.54,-0.635; 4 2.54,0.635; 5 3.81,-0.635; 6 3.81,0.635 | hole 1: 0,0; 5.08,1.016; 5.08,-1.018
EL3H7 = smd 1.5 x 0.6: ANODE -3.15,0.6; CATHODE -3.15,-0.6; COLLECTOR 3.15,0.6; EMITTER 3.15,-0.6
VSOF5 = smd 0.27 x 0.45: P$1 -0.5,-0.825; P$2 0,-0.825; P$3 0.5,-0.825; P$4 0.5,0.825; P$5 -0.5,0.825

### Placement (x,y rotation side)
C1  32.6,14.7 90 bottom
C2  27.4,9.6 270 bottom
C3  26.8,13.6 90 bottom
C4  32,19.9 180 bottom
C5  40.8,14.7 90 bottom
C6  34.7,9.6 270 bottom
C7  34.7,13.6 90 bottom
C8  40.2,19.6 180 bottom
C9  1.2,11.8 270 bottom
C10  7.5,12.4 90 bottom
C11  5.1,7.9 0 bottom
C12  12.8,12.8 270 bottom
C13  3,22.9 180 bottom
C14  6.11,23.14 0 bottom
C25  28.4,22.8 270 bottom
C26  26.9,21.8 270 bottom
FD1  7.6,2.8 0 bottom
FD2  7.6,40 0 bottom
FD3  7.6,40 0 top
FD4  7.6,2.8 0 top
INA210  2.5,17.2 270 bottom
IND1  31,10.6 90 bottom
IND2  38.3,10.6 90 bottom
MPPT1  29.6,15.5 180 bottom
MPPT2  37.8,15.5 180 bottom
PQ60_HEADER  21,35 0 top
PQ60_RECEPTACLE  21,35 180 bottom
PWR  11,10 0 bottom
R1  27.6,18.7 270 bottom
R2  26,18.7 90 bottom
R3  32,18.1 180 bottom
R4  35.8,18.8 270 bottom
R5  34.2,18.8 90 bottom
R6  40.4,18 180 bottom
R7  5.7,18.6 180 bottom
R8  21.2,11.7 270 bottom
R9  16.7,9.3 90 bottom
R10  12.3,21.2 90 bottom
R11  20.9,27 270 bottom
R12  20.5,29.6 270 bottom
R13  19.1,9.1 270 bottom
R14  16,29.8 270 bottom
R15  0.9,8.6 270 bottom
R16  2,8.6 270 bottom
R17  7.3,9.6 90 bottom
R18  9.6,26.1 270 bottom
R19  2.5,15.2 0 bottom
R20  2.7,19.9 90 bottom
R21  1.4,19.9 90 bottom
R22  5.4,15.2 0 bottom
R23  13.17,25.73 180 bottom
R24  10.2,18.2 90 bottom
R25  9.6,29.9 270 bottom
R26  8.3,26.1 270 bottom
R27  8.3,29.9 270 bottom
R28  14.9,8.4 0 bottom
R29  12.52,24.57 180 bottom
R30  26.3,28.3 0 bottom
R32  29.2,27.5 0 bottom
R33  26.8,24.8 90 bottom
R34  30,26.3 180 bottom
R36  14.5,17.3 90 bottom
R37  16.5,17.3 90 bottom
R40  16.5,12.2 270 bottom
SJ1  12,16.2 90 bottom
SOL1  18.3,3 180 bottom
SOL2  23.2,3 180 bottom
SOL3  28.1,3 180 bottom
SOL4  33,3 180 bottom
STWD100  9.6,15.7 0 bottom
U1  24,11.8 90 bottom
U9  14.9,10.5 270 bottom
U10  13.5,28.7 90 bottom
U11  18.3,28.7 90 bottom
U12  23,28.7 90 bottom
U$1  36.7,21.8 0 bottom
U$2  4.5,11.3 180 bottom
U$3  4.4,34.1 0 top
U$4  21.5,17.5 180 bottom
U$9  [SA_LOGO_SMALL]  0.7,12.8 0 top
U$10  21.5,14.9 180 bottom
U$13  [PQ60_CMP]  36.7,14.7 0 top
U$14  27.5,6.3 180 bottom
U$17  32.7,6.3 0 bottom
U$18  20.8,9.3 180 bottom
U$19  5.5,17.2 90 bottom
U$20  4.3,28 0 bottom
U$21  22,22 270 bottom
U$22  39,25.1 90 bottom
U$24  37.6,33.9 0 bottom
U$25  12.7,18.9 0 bottom
U$26  18.3,12.2 270 bottom
U$29  14.5,13.9 180 bottom
U$31  22.2,6.3 180 bottom
U$32  17,6.3 180 bottom
U$35  [UBO_LOGO]  1.8,16 0 top

### Tracks (layer width: path | path; a pad name or v marks a point on that pad's centre or on a via)
+3V3  (via drill 0.4)
  Top 0.2: PQ60_HEADER.P$57 14.1,39.5 | PQ60_HEADER.P$58 13.5,39.5 | PQ60_HEADER.P$59 12.9,39.5 | PQ60_HEADER.P$60 v12.3,39.5 | v7.9,16.7 7.9,18.6 10.4,21.1 13.2,21.1 v13.4,21.3 | v37,26.4 34,29.4 v33.8,29.4
  Top 0.3: v14.5,19.2 16,17.7 19.5,17.7 19.91,17.29 19.91,16.79 22.9,13.8 23.4,13.8 24,14.4 24,15.1 24.85,15.95 25.8,15.95 26.6,16.75 27.8,16.75 28.2,16.35 30.15,16.35 36.2,22.4 v36.2,22.7 36.2,24.6 37,25.4 v37,26.4
  Top 0.4: 14.1,39.5 13.5,39.5 12.9,39.5 v12.3,39.5 | v11.5,26 13.4,24.3 v13.4,21.3
  Bottom 0.2: PQ60_RECEPTACLE.P$60 v12.3,39.5 | 14.1,39.5 PQ60_RECEPTACLE.P$57 | PQ60_RECEPTACLE.P$58 13.5,39.5 | PQ60_RECEPTACLE.P$59 12.9,39.5 | INA210.3 4.25,16.55 4.4,16.7 4.4,18.4 | U$21.3 25.85,22.75 26.4,23.3 28.25,23.3 C25.1 28.4,22.9 27.8,22.9 27.35,22.45 C26.1 26.05,22.45 25.85,22.25 U$21.4 | 13.8,18.85 13.7,18.95 13.7,19.7 13.6,19.8 13.4,19.8 13.2,19.6 U$25.6 | R32.1 30,27.35 30,25.7 30.2,25.5 32.8,25.5 33.4,26.1 33.4,29 v33.8,29.4 | U$22.1 38.34,26.4 v37,26.4 | 4.4,18.4 3.6,19.2 3.6,19.8 2.85,20.55 R20.2 | 4.4,18.4 4.4,20 4.9,20.5 6.2,20.5 6.5,20.2 6.5,19.9 7.3,19.1 7.3,17.9 7.9,17.3 v7.9,16.7
  Bottom 0.3: C25.1 35.45,23.45 v36.2,22.7
  Bottom 0.4: 14.1,39.5 13.5,39.5 12.9,39.5 v12.3,39.5 12,39.5 11.4,38.9 v11.5,26 | v14.5,19.2 R36.2 13.8,18.85 13.8,19.8 13.4,20.2 v13.4,21.3
+3V3_ISEN
  Bottom 0.2: 11.78,18.52 U$25.3 12.07,18.5 11.8,18.5 11.78,18.52 | U$21.16 17.4,19.6 16.7,20.3 16.7,20.6 15.1,22.2 12.65,22.2 R10.2 12.15,21.85 11.5,21.2 11.2,21.2 10.7,20.7 10.7,19.9 11.2,19.4 11.2,19.1 11.78,18.52
+3V3_REG  (via drill 0.4)
  Top 0.2: v18.2,13.51 16.61,15.1 v16.4,15.1
  Top 0.4: v2.8,27.4 2.1,26.7 2.1,20.2 2.8,19.5 2.8,18.1 2.2,17.5 2.2,15.4 3.4,14.2 3.4,13.2 2.9,12.7 2.9,10.35 3.56,9.68 3.56,7.99 5.9,5.65 | v16.4,15.1 16,15.1 15.4,14.5 15.4,13.4 15.3,13.3 15.31,13.29 15.31,7.08 13.32,5.09 6.47,5.09 6.22,5.34 6.21,5.34 5.9,5.65 | 5.9,5.65
  Bottom 0.2: 13.55,16.55 13.3,16.8 13.3,17.8 13.2,17.9 U$25.1 | 13.55,16.55 13.6,16.5 14.45,16.5 | v18.2,13.51 18.68,13.04 U$26.1 | 13.55,16.55 13.6,16.6 14.4,16.6 R36.1
  Bottom 0.4: R36.1 R37.1 16.4,16.35 v16.4,15.1 | U$20.P$3 2.15,24.8 C13.1 2.8,23.55 v2.8,27.4
+3V3_SW  (via drill 0.4)
  Top 0.4: v15.1,21 15.1,22.3 15.3,22.5 15.3,25.4 v15.1,25.6
  Bottom 0.2: R37.2 16.55,18.15 17.5,17.2 17.5,15.8 17.3,15.6 17.3,12.9 17.5,12.7 U$26.6
  Bottom 0.4: U10.4 12.54,28.43 12.8,28.7 14.7,28.7 | U10.1 14.46,28.46 14.7,28.7 | U11.4 17.34,28 16.93,28.4 15.3,28.4 15,28.7 14.7,28.7 | R37.2 16.5,18.6 | 16.5,18.8 15.1,20.2 v15.1,21
  Bottom 0.406: 16.5,18.6 16.5,18.8 | v15.1,25.6 15.1,26.3 14.46,26.93 U10.1
+3V3_SW1  (via drill 0.4)
  Top 0.2: PQ60_HEADER.P$1 12.3,34.6 | PQ60_HEADER.P$2 12.9,34 12.3,34.6 | 12.3,34.6 v12.29,34.69
  Bottom 0.2: PQ60_RECEPTACLE.P$2 PQ60_HEADER.P$2 12.9,34 12.3,34.6 | v12.29,34.69 12.3,34.6 | 12.3,34.6 PQ60_RECEPTACLE.P$1
  Bottom 0.3: U10.5 12.54,30.93 12.3,31.17 PQ60_RECEPTACLE.P$1 | PQ60_HEADER.P$2 12.9,31.3 12.6,31
+3V3_SW1_EN
  Bottom 0.2: U$21.18 18.65,20.75 17.1,22.3 16.8,22.3 15.2,23.9 13.6,23.9 13.17,24.33 R29.2 U10.3 | U10.3
+3V3_SW2  (via drill 0.4)
  Top 0.2: PQ60_HEADER.P$5 v14.7,34.5 14.8,34.5 15.3,34 PQ60_HEADER.P$6
  Bottom 0.2: 14.77,32.15 PQ60_RECEPTACLE.P$5 v14.7,34.5 14.8,34.5 15.3,34 PQ60_RECEPTACLE.P$6
  Bottom 0.3: PQ60_RECEPTACLE.P$5 14.7,31 | U10.8 14.46,30.77 14.7,31 | 14.7,31 15.2,31 15.3,31.1 PQ60_RECEPTACLE.P$6
+3V3_SW2_EN
  Bottom 0.2: U$21.19 18.75,21.25 17.3,22.7 17,22.7 15.4,24.3 14.3,24.3 13.82,24.78 R23.2 U10.2
+3V3_SW3  (via drill 0.4)
  Top 0.2: PQ60_HEADER.P$9 v17.1,34.5 17.2,34.5 17.7,34 PQ60_HEADER.P$10
  Bottom 0.2: PQ60_RECEPTACLE.P$10 PQ60_HEADER.P$10 | PQ60_HEADER.P$10 17.7,34 17.2,34.5 v17.1,34.5 PQ60_RECEPTACLE.P$9 17.1,32.1 | 17.64,32.71 PQ60_HEADER.P$10
  Bottom 0.3: 17.1,32.1 17.1,31.1 17.34,30.86 | U11.5 17.34,30.93 17.7,31.3 PQ60_HEADER.P$10
+3V3_SW3_EN
  Bottom 0.2: U$21.20 18.85,21.75 17.5,23.1 17.2,23.1 16.3,24 16.3,25.4 17.2,26.3 17.8,26.3 17.97,26.47 U11.3 17.97,28.13 17.2,28.9 16.9,28.9 16.65,29.15 R14.2
+3V3_SW_ISEN  (via drill 0.4)
  Top 0.2: v19.4,13.7 19.4,12.57 19.38,12.57 v17.68,10.88
  Bottom 0.2: U$26.3 18.68,11.28 18.6,11.2 18.03,11.2 17.71,10.88 v17.68,10.88 16.78,9.97 16.78,9.95 R9.2 | U$21.15 20.75,19.15 20.2,18.6 18.4,18.6 17.9,18.1 17.9,15.5 17.8,15.4 17.8,14.7 18.2,14.3 18.8,14.3 v19.4,13.7
+5V_USB  (via drill 0.4)
  Top 0.2: PQ60_HEADER.P$22 v24.9,34.5 24.6,34.5 24.3,34.2 PQ60_HEADER.P$21
  Bottom 0.2: PQ60_RECEPTACLE.P$22 v24.9,34.5 24.6,34.5 24.3,34.2 PQ60_RECEPTACLE.P$21
  Bottom 0.3: 24.9,31.55 24.9,30.5 24.3,31.1 PQ60_RECEPTACLE.P$21
  Bottom 0.4: 24.9,30.5 24.9,29.7 25.65,28.95 R30.2 25.65,28.25 25.45,28.25 24.63,27.43 U12.1 23.96,27.7
BAT_BUS_ISEN  (via drill 0.4)
  Top 0.2: v5.7,19.7 5.8,19.8 7.7,19.8 8.5,20.6 8.5,21.4 10.8,23.7 10.8,25.5 10.6,25.7 10.6,26.6 11.5,27.5 14.8,27.5 16.2,26.1 16.2,22.2 15.9,21.9 15.9,20 17.3,18.6 19.9,18.6 20.8,17.7 20.8,17.2 21.5,16.5 v22.1,16.5
  Bottom 0.2: U$21.11 22.75,18.75 22.4,18.4 22.4,16.8 v22.1,16.5 | U$19.3 5.12,17.88 5,18 5.05,18.05 R7.1 5.1,18.65 5.1,19.3 5.5,19.7 v5.7,19.7
BAT_RAW_ISEN  (via drill 0.4)
  Top 0.2: v21.6,17.6 20.2,19 17.5,19 16.3,20.2 16.3,21.6 16.6,21.9 16.6,26.3 15,27.9 11.3,27.9 10.2,26.8 10.2,25.4 10.4,25.2 10.4,23.9 8.1,21.6 8.1,21.5 v7.3,20.7
  Bottom 0.2: INA210.6 0.75,17.85 0.5,18.1 0.5,21 0.7,21.2 3.4,21.2 3.6,21 4.2,21 4.4,21.2 6.8,21.2 v7.3,20.7 | U$21.12 22.25,18.85 21.6,18.2 v21.6,17.6
BATV_BUS  (via drill 0.4)
  Top 0.2: PQ60_HEADER.P$52 17.1,39.5 | PQ60_HEADER.P$51 17.7,39.5 v17.8,39.5 18.3,39.5 PQ60_HEADER.P$50 | PQ60_HEADER.P$49 18.9,39.5
  Top 0.4: 17.1,39.5 v17.8,39.5 18.9,39.5 | 19.3,29.6 21.5,29.6 22.01,29.09 v22.01,28.6 | 19.3,29.6 8.4,29.6 8.15,29.85 | v19.3,28.6 19.3,29.6 | v7.7,31.8 7.7,30.3 8.15,29.85 | 8.15,29.85 7.4,29.1 7.4,27.8 9.2,26 v9.2,24.5 | v7.6,14.9 8.9,16.2 v8.9,18.3
  Bottom 0.2: 18.9,39.5 PQ60_RECEPTACLE.P$49 | PQ60_RECEPTACLE.P$51 17.7,39.5 | PQ60_RECEPTACLE.P$50 18.3,39.5 | PQ60_RECEPTACLE.P$52 17.1,39.5 v17.8,39.5 | R22.1 6.25,16.05 5.9,16.4 5.9,16.68 U$19.6 | 9,24.3 v9.2,24.5
  Bottom 0.4: 17.1,39.5 17.7,39.5 | 18.9,39.5 18.3,39.5 v17.8,39.5 16.9,40.4 11.9,40.4 10.7,39.2 10.7,36.1 8.6,34 8.6,32.7 v7.7,31.8 | U11.1 19.27,28.57 v19.3,28.6 | U12.4 22.04,28.57 v22.01,28.6 | R22.1 7.3,15.2 v7.6,14.9 | R18.2 9.6,24.9 v9.2,24.5 9.2,18.6 v8.9,18.3
BATV_SENS  (via drill 0.4)
  Top 0.2: v20.1,25.3 20.1,25.6 17,28.7 10.2,28.7 9.3,27.8 v9.3,27.7
  Bottom 0.2: v20.1,25.3 20.25,25.15 U$21.25 | R18.1 9.6,27.4 v9.3,27.7 9.6,28 R25.2
BATV_SW1  (via drill 0.4)
  Top 0.2: PQ60_HEADER.P$13 v19.5,34.5 19.6,34.5 20.1,34 PQ60_HEADER.P$14
  Bottom 0.2: PQ60_RECEPTACLE.P$13 v19.5,34.5 19.6,34.5 20.1,34 20.1,32.7 PQ60_RECEPTACLE.P$14 20.1,32.1
  Bottom 0.3: U11.8 19.27,30.77 19.5,31 | 19.5,31 PQ60_RECEPTACLE.P$13 | 20.1,32.7 20.1,31.2 19.9,31 19.5,31
BATV_SW1_EN
  Bottom 0.2: U11.2 18.63,26.53 | U$21.21 18.95,22.25 17.7,23.5 17.4,23.5 16.7,24.2 16.7,25.2 17.4,25.9 18,25.9 18.63,26.53 | R12.2 20.5,28.5 20.1,28.1 20.1,26.95 19.61,26.46 18.7,26.46 18.63,26.53
BATV_SW2  (via drill 0.4)
  Top 0.2: PQ60_HEADER.P$17 v21.9,34.5 22.5,34.2 PQ60_HEADER.P$18
  Bottom 0.2: 22.54,32.12 PQ60_RECEPTACLE.P$18 22.5,34.2 v21.9,34.5 PQ60_RECEPTACLE.P$17 21.9,31.8
  Bottom 0.3: PQ60_RECEPTACLE.P$18 22.5,31.4 22.04,30.93 | U12.5 22.04,30.96 21.9,31.1 PQ60_RECEPTACLE.P$17
BATV_SW2_EN
  Bottom 0.2: U12.3 22.67,26.67 22.2,26.2 21,26.2 | U$21.22 19.05,22.75 17.9,23.9 17.6,23.9 17.1,24.4 17.1,25 17.6,25.5 18.2,25.5 18.76,26.06 19.86,26.06 20,26.2 20.75,26.2 R11.2 | 20.95,26.25 21,26.2 | 20.55,26.2 R11.2 | R11.2 20.85,26.2 21,26.2 | 21,26.2 R11.2
CHG_INPUT  (via drill 0.4)
  Top 0.2: v10.5,21.9 6,17.4 6,15.6
  Top 0.4: v24.5,28.7 23.7,28.7 22.15,30.25 11.15,30.25 10.5,30.9 10.5,31.3 v10.2,31.6 | 6,15.6 v6,13.9 7.2,12.7 v7.2,7.9
  Bottom 0.2: U$2.6 4.25,13.25 4.9,13.9 v6,13.9
  Bottom 0.25: C11.1 5.25,8.6 U$2.13
  Bottom 0.3: U$18.6 20.3,8.5 20.1,8.3 19.15,8.3 | U12.8 23.96,29.04 24.1,28.9 24.3,28.9 v24.5,28.7
  Bottom 0.4: C11.1 v7.2,7.9 13.1,7.9 13.9,7.1 17,7.1 18.15,8.25 R13.2 19.15,8.3 | v10.2,31.6 10.7,31.1 10.7,27 10.5,26.8 v10.5,21.9
EN  (via drill 0.4)
  Top 0.2: PQ60_HEADER.P$27 v27.9,30.1 29.1,28.9 30,28.9 30.4,29.3 31.4,29.3 33.4,27.3 33.4,26.1 32.8,25.5 26.9,25.5 25.6,24.2 | 25.6,24.2 24.2,24.2 23.3,23.3 20.3,23.3 19.8,22.8 18.7,22.8 18.5,22.6 18.5,20.4 17.9,19.8 17.3,19.8 16.7,20.4 16.7,21.3 17,21.6 17,26.5 15.2,28.3 11.1,28.3 9.8,27 9.8,25.1 10,24.9 10,24.1 9.69,23.79 9.5,23.6 8.6,22.7 8.1,22.7 v7.3,21.9 | 25.6,24.2 v25.6,23.6 | v17.9,9.3 16.6,9.3 15.9,10 15.9,12 16.5,12.6 v16.5,13.9
  Bottom 0.2: v27.9,30.1 PQ60_RECEPTACLE.P$27 | U$21.2 25.25,23.25 v25.6,23.6 | R28.1 U9.4 15.74,9.3 v17.9,9.3 | 14,15 U$29.P$1 14,15.1 | v16.5,13.9 15.9,13.9 15.6,14.2 15.6,15 15.3,15.3 14.2,15.3 14,15.1 | v7.3,21.9 7.4,21.9 8.2,21.1 8.2,19.7 7.9,19.4 7.9,18.2 8.95,17.15 STWD100.1 8.95,16.05 9.6,15.4 9.6,14.6 11.1,13.1 11.8,13.1 11.9,13.2 12.35,13.2 C12.1 13.5,14.35 13.5,15 13.7,15.2 13.9,15.2 14,15.1
GND  (via drill 0.4)
  Top 0.2: PQ60_HEADER.P$56 14.7,39.5 | PQ60_HEADER.P$55 15.3,39.5 v15.6,39.5 | PQ60_HEADER.P$54 15.9,39.5 | PQ60_HEADER.P$53 16.5,39.5 | PQ60_HEADER.P$3 13.5,33.4 v13.5,34.5 13.6,34.5 14.1,34 14.1,33.3 PQ60_HEADER.P$4 | PQ60_HEADER.P$7 15.9,33.2 v15.9,34.5 16,34.5 16.5,34 16.5,33.1 PQ60_HEADER.P$8 | PQ60_HEADER.P$11 18.3,33 v18.3,34.5 18.4,34.5 18.9,34 18.9,33 PQ60_HEADER.P$12 | PQ60_HEADER.P$15 v20.7,34.5 20.8,34.5 21.3,34 PQ60_HEADER.P$16 | PQ60_HEADER.P$19 23.1,34.2 v23.4,34.5 23.7,34.2 23.7,33.3 PQ60_HEADER.P$20 | v28.5,34.5 PQ60_HEADER.P$28 | PQ60_HEADER.P$23 25.5,33.9 v26.1,34.5 26.1,33.2 PQ60_HEADER.P$24 26.1,32.4 | PQ60_HEADER.P$48 19.5,39.5 | v20.4,39.5 20.1,39.5 PQ60_HEADER.P$47 | 20.9,39.5 20.7,39.5 PQ60_HEADER.P$46 | 21.3,39.5 PQ60_HEADER.P$45 | 10.7,13.2 9.8,14.1 v9.8,17.5 9.8,18.6 v11.5,20.3 11.6,20.4 13.6,20.4 14.3,21.1 v14.3,23.1 | v3.9,21.8 4.3,21.4 4.3,20.9 | U$2.17 4.3,11.5 4.3,16.5 INA210.2 | 13,7.5 14.8,9.3 14.8,13.6 v14.5,13.9 v11.7,11.8
  Top 0.3: PQ60_HEADER.P$23 25.5,30.9 | 26.1,33.2 26.1,31.1 25.9,30.9 | 23.7,33.3 23.7,30.9 | PQ60_HEADER.P$19 23.1,30.9 | 21.3,30.9 PQ60_HEADER.P$16 | 20.7,32.7 20.7,30.9 | 18.9,33 18.9,30.9 | 18.3,33 18.3,30.9 | 16.5,33.1 16.5,30.9 | 15.9,33.2 15.9,30.9 | 13.5,33.4 13.5,30.9 | 14.1,30.9 14.1,33.3
  Top 0.4: v15.6,39.5 15.9,39.5 | 14.7,39.5 v15.6,39.5 | v15.6,39.5 16.5,39.5 | 19.5,39.5 20.1,39.5 | 20.9,39.5 21.3,39.5 | 20.7,39.5 v20.4,39.5 19.5,40.4 14.7,40.4 | 25.9,30.9 25.5,30.9 23.7,30.9 23.1,30.9 21.3,30.9 20.7,30.9 18.9,30.9 18.3,30.9 16.5,30.9 15.9,30.9 14.1,30.9 13.5,30.9 11.7,30.9 11.4,31.2 11.4,39.9 11.9,40.4 14.7,40.4 | v15.6,39.5 14.7,40.4 | v16.7,8.1 16.7,3.85 SOL1.P$1 | v1.13,10.59 1.1,10.5
  Bottom 0.2: PQ60_RECEPTACLE.P$56 14.7,39.5 | PQ60_RECEPTACLE.P$55 15.3,39.5 v15.6,39.5 15.9,39.5 PQ60_RECEPTACLE.P$54 15.9,35.3 | PQ60_RECEPTACLE.P$53 16.5,39.5 | v18.3,34.5 PQ60_RECEPTACLE.P$11 18.27,32.12 | PQ60_RECEPTACLE.P$19 23.1,34.2 v23.4,34.5 23.7,34.2 PQ60_RECEPTACLE.P$20 | PQ60_RECEPTACLE.P$24 v26.1,34.5 25.5,33.9 PQ60_RECEPTACLE.P$23 | PQ60_RECEPTACLE.P$28 v28.5,34.5 | PQ60_RECEPTACLE.P$4 14.1,34 13.6,34.5 v13.5,34.5 14.3,35.3 15.3,35.3 | PQ60_RECEPTACLE.P$8 16.5,34 16,34.5 v15.9,34.5 | PQ60_RECEPTACLE.P$12 PQ60_HEADER.P$12 18.9,34 18.4,34.5 v18.3,34.5 | v20.7,34.5 20.8,34.5 21.3,34 PQ60_RECEPTACLE.P$16 21.3,31 | PQ60_RECEPTACLE.P$48 19.5,39.5 | 21.3,39.5 PQ60_RECEPTACLE.P$45 | PQ60_RECEPTACLE.P$46 20.7,39.5 | 20.1,39.5 PQ60_RECEPTACLE.P$47 20.1,35.5 19.9,35.3 | PQ60_RECEPTACLE.P$7 v15.9,34.5 | v15.9,34.5 15.9,34.7 15.3,35.3 | 17.5,35.3 v18.3,34.5 | v20.7,34.5 PQ60_RECEPTACLE.P$15 20.7,30.9 | v20.7,34.5 19.9,35.3 | 19.9,35.3 17.5,35.3 | 17.5,35.3 15.9,35.3 | 15.9,35.3 15.3,35.3 | MPPT2.3 37.8,17.3 37.4,17.7 37.4,18.9 v38.1,19.6 | MPPT2.EXP 36.4,15.5 36.2,15.3 36.2,14.4 36,14.2 34.75,14.2 C7.2 | MPPT1.3 29.6,17.3 29.2,17.7 29.2,18.5 29.7,19 32.4,19 | 32.4,19 32.65,18.75 R3.2 | 32.4,19 32.85,19.45 C4.2 | R3.2 32.7,18.15 R5.1 | R3.2 32.6,18.05 C1.2 33.35,15.55 33.7,15.2 33.7,14.45 34.05,14.1 34.1,14.1 | MPPT1.EXP 28.2,15.5 27.9,15.2 27.9,14.7 27.45,14.25 C3.2 26.8,14.6 25.9,15.5 25.9,17.95 R2.1 | U$18.5 20.8,8.43 21.03,8.2 21.67,8.2 22.2,8.72 22.2,11.1 22.84,11.74 | INA210.2 2.7,17.2 2.5,17.4 2.5,18.2 2.1,18.6 1.5,18.6 1.4,18.7 R21.1 | 10.2,17.4 R24.1 | 9.85,17.55 R24.1 | 28.25,22.15 C25.2 27.9,21.65 v27.9,21.4 27.5,21.4 27.25,21.15
  Bottom 0.2: 17.5,12.2 U$26.5 17.15,12.2 R40.1 15.22,12.85 U$29.P$4 15,13.4 v14.5,13.9 U$29.P$2 | 16.7,8.75 R9.1 v16.7,8.1 16.2,7.6 15.1,7.6 14.9,7.8 U9.5 | U$25.5 12.7,20.15 R10.1 12.05,20.3 v11.5,20.3 | STWD100.2 9.6,17.3 v9.8,17.5 10.15,17.5 R24.1 | 22.45,21.75 22.05,21.75 U$21.GND@1 | 23.55,21.75 U$21.5 25.65,21.75 26.15,21.25 | 22.45,21.75 22.1,21.4 22.25,21.25 U$21.6 | U$21.GND@2 23.25,22.15 U$21.GND@3 23.55,21.75 | 23.55,21.75 22.45,21.75 | R12.1 20.5,30.7 20.7,30.9 | 21.3,31 21.2,30.9 20.7,30.9 | R11.1 21.25,28 21.25,29.55 21.3,29.6 21.3,31 | R14.1 15.9,30.55 | 16.1,30.7 16.1,30.4 15.9,30.4 | U$22.5 39,29.55 39,32.4 39.9,33.3 U$24.CATHODE | 26.7,21.25 C26.2 26.25,21.15 26.15,21.25 | 26.15,21.25 24.35,21.25 arc-90 24.3,21.3 | R34.2 31.2,26.3 31.6,25.9 32.6,25.9 33,26.3 33,32.6 33.7,33.3 U$24.EMITTER | 4.25,8.6 U$2.15 4.25,11.05 | 4.25,8.6 C11.2 | 4.25,8.6 4.75,9.1 U$2.14 4.75,11.05 | R6.2 C8.2 | C12.2 13.7,11.05 13.7,10.5 U9.7 | R29.1 11.87,24.97 12.52,25.62 R23.1 | 5.25,12.05 U$2.8 | C10.2 6.55,13.25 5.97,12.68 U$2.9 | U$2.4 3.02,13.12 3.75,13.85 | 4,14.1 3.75,13.85 | 3.75,13.85 3.75,11.15 4.24,10.66 | 4.24,10.66 4.24,9.42 | 4.24,10.66 4.24,11.04 U$2.17 | 3.8,22.85 C13.2 | v3.9,21.8 3.9,23 | U$19.5 6.7,17.2 v6.8,17.1 6.8,18.15 R7.2
  Bottom 0.25: C5.2 40.8,16.6 41.05,16.85 R6.2 | MPPT2.3 MPPT2.EXP | U$2.17 4.75,11.05 | U$2.7 4.75,11.3 U$2.17 | U$2.9 5.25,12.05 | 5.25,12.05 arc90 U$2.17 | 5.25,12.05 arc-90 U$2.17 | U$2.4 3.75,12.05 | 3.75,12.05 arc-90 U$2.17 | U$2.5 3.75,12.05 | 3.75,12.05 arc90 U$2.17
  Bottom 0.3: 23.6,11.52 23.29,11.29 22.84,11.74 22.23,12.35 R8.1 | 23.6,11.52 U1.11 | U1.11 23.8,11.3 24.31,11.81 | 24.31,11.29 U1.11 | U1.9 24.51,12.31 U1.11 | 23.49,11.29 U1.11 | U1.3 U1.11 | U1.2 24.51,11.29 U1.11 | U1.4 23.49,11.4 23.6,11.52 | PQ60_RECEPTACLE.P$19 23.1,31.2 | U11.6 17.97,30.77 18.3,31.1 | PQ60_RECEPTACLE.P$3 13.5,31.1 | U10.6 13.17,30.77 13.5,31.1 | 18.3,31.1 18.8,31.1 18.9,31.2 PQ60_HEADER.P$12 | 18.3,31.1 PQ60_RECEPTACLE.P$11 | PQ60_RECEPTACLE.P$20 23.7,31.2 23.6,31.1 23,31.1 22.67,30.77 U12.6 | 13.5,31.1 14,31.1 14.1,31.2 PQ60_RECEPTACLE.P$4 | PQ60_RECEPTACLE.P$24 26.1,30.9 | PQ60_RECEPTACLE.P$28 28.5,30.7 28.8,30.4 28.8,29.7 28.3,29.2 26.4,29.2 25.8,29.8 25.8,30.5 26.1,30.8 26.1,30.9 | PQ60_RECEPTACLE.P$23 25.5,31 25.6,30.9 26.1,30.9 | U9.5 U9.7
  Bottom 0.305: PQ60_RECEPTACLE.P$3 v13.5,34.5 | PQ60_RECEPTACLE.P$8 16.5,31.1 16.1,30.7
  Bottom 0.4: 14.7,39.5 v15.6,39.5 16.5,39.5 | 19.5,39.5 20.1,39.5 v20.4,39.5 | 21.3,39.5 20.7,39.5 v20.4,39.5 | C7.2 34.25,14.25 34.1,14.1 33.7,13.7 33.7,8.7 | 33.7,8.7 33.7,7.75 33.1,7.15 33.1,5.1 34.8,3.4 34.8,2.5 34.1,1.8 32.25,1.8 | C6.2 33.75,8.75 33.7,8.7 | C3.2 26.25,14.25 25.9,13.9 25.9,12.2 26.29,11.81 | 26.3,8.6 26.3,11.8 26.29,11.81 | 26.3,8.6 26.3,8 27.35,6.95 SOL3.P$1 27.35,1.8 | C2.2 26.45,8.75 arc90 26.3,8.6 | 24.31,11.81 26.29,11.81 | 22.45,1.8 17.55,1.8 SOL1.P$1 | 22.45,1.8 27.35,1.8 | 27.35,1.8 32.25,1.8 | SOL4.P$1 32.25,1.8 | SOL2.P$1 22.45,1.8 | 31.5,39 29.4,41.1 21.3,41.1 20.4,40.2 v20.4,39.5 | C9.2 v1.13,10.59 | R15.1 0.8,9.8 v1.13,10.59 | R16.1 2,9.6 1.5,10.1 v1.13,10.59 | INA210.2 2.9,17.2
  other vias: 3.3,30.7 4.3,31.4 5.3,30.7 4.5,11.3 11.9,23.3 1.3,18.8 1.9,6.6 15.1,1.3 15.1,3.2 21,22 23,22 23.2,16.1
  pour Top (isolate 0.3): 6,42 36,42 36,39 arc90 39,36 42,36 42,6 39,6 arc90 36,3 36,0 6,0 6,3 arc90 3,6 0,6 0,36 3,36 arc90 6,39
  pour Bottom (isolate 0.3): 6,42 36,42 36,39 arc90 39,36 42,36 42,6 39,6 arc90 36,3 36,0 6,0 6,3 arc90 3,6 0,6 0,36 3,36 arc90 6,39
GPIO0  (via drill 0.4)
  Top 0.2: PQ60_HEADER.P$25 v26.7,30.1 27.5,29.3 28.1,29.3 28.9,28.5 30.2,28.5 30.6,28.9 31.2,28.9 33,27.1 33,26.3 32.6,25.9 26.7,25.9 25.4,24.6 24,24.6 23.1,23.7 20.1,23.7 19.6,23.2 18.5,23.2 17.6,22.3 v17.6,20.7
  Bottom 0.2: PQ60_RECEPTACLE.P$25 v26.7,30.1 | U$21.17 18.05,20.25 v17.6,20.7
GPIO1  (via drill 0.4)
  Top 0.2: PQ60_HEADER.P$26 v27.3,34.5
  Bottom 0.2: v27.3,34.5 PQ60_RECEPTACLE.P$26
GPIO2  (via drill 0.4)
  Top 0.2: PQ60_HEADER.P$34 v27.9,35.5
  Bottom 0.2: v27.9,35.5 PQ60_RECEPTACLE.P$34
GPIO3  (via drill 0.4)
  Top 0.2: PQ60_HEADER.P$35 v27.3,39.2
  Bottom 0.2: v27.3,39.2 PQ60_RECEPTACLE.P$35
GPIO4  (via drill 0.4)
  Top 0.2: PQ60_HEADER.P$36 v26.7,35.5
  Bottom 0.2: v26.7,35.5 PQ60_RECEPTACLE.P$36
GPIO5  (via drill 0.4)
  Top 0.2: PQ60_HEADER.P$37 26.1,38.7 26.5,39.1 26.5,40 v26.6,40.1
  Bottom 0.2: PQ60_RECEPTACLE.P$37 26.1,38.7 26.5,39.1 26.5,40 v26.6,40.1
GPIO6  (via drill 0.4)
  Top 0.2: PQ60_HEADER.P$38 25.5,39.3 v25.6,39.4
  Bottom 0.2: PQ60_RECEPTACLE.P$38 25.5,39.3 v25.6,39.4
GPIO7  (via drill 0.4)
  Top 0.2: PQ60_HEADER.P$39 24.9,39 24.7,39.2 v24.7,40.1
  Bottom 0.2: PQ60_RECEPTACLE.P$39 24.9,39 24.7,39.2 v24.7,40.1
GPIO8  (via drill 0.4)
  Top 0.2: PQ60_HEADER.P$40 v24.3,35.5
  Bottom 0.2: v24.3,35.5 PQ60_RECEPTACLE.P$40
GPIO9  (via drill 0.4)
  Top 0.2: PQ60_HEADER.P$41 23.7,39.2 v23.8,39.3
  Bottom 0.2: PQ60_RECEPTACLE.P$41 23.7,39.2 v23.8,39.3
GPIO10  (via drill 0.4)
  Top 0.2: PQ60_HEADER.P$42 23.1,39 22.7,39.4 v22.6,39.4
  Bottom 0.2: PQ60_RECEPTACLE.P$42 23.1,39 22.7,39.4 v22.6,39.4
GPIO11  (via drill 0.4)
  Top 0.2: PQ60_HEADER.P$43 22.5,35.5 v22.6,35.4
  Bottom 0.2: PQ60_RECEPTACLE.P$43 22.5,35.5 v22.6,35.4
GPIO12  (via drill 0.4)
  Top 0.2: PQ60_HEADER.P$44 21.9,39.1 21.8,39.2 v21.8,40.2
  Bottom 0.2: PQ60_RECEPTACLE.P$44 21.9,39.1 21.8,39.2 v21.8,40.2
MISO  (via drill 0.4)
  Top 0.2: PQ60_HEADER.P$32 v29.1,35.5
  Bottom 0.2: v29.1,35.5 PQ60_RECEPTACLE.P$32
MOSI  (via drill 0.4)
  Top 0.2: PQ60_HEADER.P$31 29.7,39.2 v29.8,39.3
  Bottom 0.2: v29.8,39.3 29.7,39.2 PQ60_RECEPTACLE.P$31
MPPT1  (via drill 0.4)
  Top 0.4: v24.5,9.2 24.7,9 26.3,9 27.4,10.1 v27.4,11.7 27.4,15.2 v27.1,15.5
  Bottom 0.25: MPPT1.9 29.1,13.4 28.9,13.2 28.6,13.2 28.4,13 28.4,10.6 28.25,10.45 C2.1 v27.4,11.7
  Bottom 0.3: U1.1 24.99,9.69 v24.5,9.2
  Bottom 0.4: R1.2 27.6,16 v27.1,15.5
MPPT2  (via drill 0.4)
  Top 0.4: v34.7,15.6 v34.7,11.7 31.3,8.3 23.7,8.3 v23,9
  Bottom 0.25: MPPT2.9 37.3,13.6 36.9,13.2 35.9,13.2 35.7,13 35.7,10.8 35.35,10.45 C6.1
  Bottom 0.3: U1.5 v23.01,9.01 v23,9
  Bottom 0.4: v34.7,11.7 C6.1 | R4.2 35.8,16.7 v34.7,15.6
MPPT_RAW  (via drill 0.4)
  Top 0.2: v18.7,10.24 19.2,9.7 19.2,6.3 v17.8,4.9 | v8,24.5 8.1,24.6 8.1,26.2 6.9,27.4 6.2,27.4 2.6,23.8 2.6,20.5 3.3,19.8 3.3,17.8 2.8,17.3 2.8,15.6 3.9,14.5 3.9,12.7 3.67,12.47 3.67,10.71 4.26,10.12 4.26,8.41 6.58,6.09 12.5,6.09 v12.96,6.55
  Bottom 0.2: U1.10 24.99,13.91 24.8,14.1 22.9,14.1 23.01,13.99 U1.6 | U$18.1 20.3,9.8 20.1,10 19.8,10 19.75,9.95 R13.1 18.85,10.24 v18.7,10.24 | R26.2 8.3,24.8 v8,24.5 | v12.96,6.55 14.61,4.9 v17.8,4.9
  Bottom 0.3: 22.9,14.1 22.6,14.1 21.6,13.1 20.6,13.1 19.4,11.9 19.4,10.8 19.1,10.5 R13.1
MPPTV_SENS  (via drill 0.4)
  Top 0.2: v21.5,25.35 21.15,25.35 17.4,29.1 9.1,29.1 v8.3,28.3
  Bottom 0.2: U$21.26 20.75,24.85 21.25,25.35 v21.5,25.35 | R26.1 v8.3,28.3 R27.2
N$1
  Bottom 0.25: MPPT1.7 30.1,13.5 29.6,13 29.6,11.6 29.27,11.28 IND1.P$1
N$2  (via drill 0.4)
  Top 0.4: v32.1,7.6 v22.2,7.6
  Bottom 0.25: MPPT1.6 30.6,13.5 30.7,13.4 31.2,13.4 32.73,11.88 IND1.P$3 32.6,10.72 C1.1
  Bottom 0.4: v32.1,7.6 32.73,8.22 IND1.P$3 | v22.2,7.6 21.76,7.6 U$31.P$1 20.46,6.34 19.7,7.1 18.1,7.1 17.8,6.8 17.8,6.5 17.6,6.3 U$32.P$1
N$3
  Bottom 0.25: MPPT2.7 38.3,13.5 36.58,11.78 IND2.P$1
N$4
  Bottom 0.2: MPPT1.10 28.6,13.8 28.5,13.7 28.3,13.7 27.55,12.95 C3.1
N$5
  Bottom 0.2: MPPT2.10 36.8,13.8 36.7,13.7 35.7,13.7 34.95,12.95 C7.1 34.75,12.75
N$6  (via drill 0.4)
  Top 0.4: v25.7,4.9 v35.2,4.9
  Bottom 0.25: MPPT2.6 38.8,13.5 40.02,12.28 | 40.02,12.28 IND2.P$3 | 40.02,12.28 40.8,13.05 C5.1
  Bottom 0.4: IND2.P$3 40.02,8.62 38.6,7.2 35.34,7.2 U$17.P$1 34.44,5.66 v35.2,4.9 | U$14.P$1 25.7,6.3 v25.7,4.9
N$7
  Bottom 0.2: MPPT2.1 36.8,17.1 36.6,17.3 36.6,19.1 36.25,19.45 R4.1 R5.2
N$8
  Bottom 0.2: MPPT1.2 29.1,17.2 28.8,17.5 28.8,18.7 29.5,19.4 30.2,19.4 30.7,19.9 C4.1
N$9
  Bottom 0.2: MPPT1.1 28.6,17.1 28.4,17.3 28.4,18.9 27.95,19.35 R1.1 R2.2
N$10
  Bottom 0.2: MPPT2.5 38.8,17.2 39.6,18 R6.1
N$11
  Bottom 0.2: MPPT2.2 37.3,17.2 37,17.5 37,19.7 37.7,20.4 38.5,20.4 39.3,19.6 C8.1
N$12  (via drill 0.4)
  Top 0.2: v38.3,18.1 35.6,15.4 35.6,9.6 32.7,6.7 21.7,6.7 21.3,7.1 21.3,8.6 25.4,12.7 v25.4,14.7
  Bottom 0.2: MPPT2.4 v38.3,18.1 | U$10.P$2 25.2,14.9 v25.4,14.7
N$13
  Bottom 0.4: SOL4.P$2 30.96,5.79 U$17.P$2
N$14  (via drill 0.4)
  Top 0.2: 30.1,17.6 v30.1,18.1 30.1,17.5 29.4,16.8 28.4,16.8 28,17.2 26.4,17.2 25.7,16.5 25,16.5 v24.7,16.8
  Bottom 0.2: MPPT1.4 v30.1,18.1 | U$4.P$2 23.7,17.5 24.4,16.8 v24.7,16.8
N$15
  Bottom 0.2: MPPT1.5 30.6,17.35 R3.1
N$16
  Bottom 0.4: SOL3.P$2 29.24,3 U$14.P$2
N$17
  Bottom 0.4: U$31.P$2 SOL2.P$2
N$18
  Bottom 0.4: U$32.P$2 18.74,3.31 SOL1.P$2
N$19
  Bottom 0.2: U$21.7 26.05,20.75 26.3,20.5 28.2,20.5 30.02,22.25 U$1.P$2
N$20  (via drill 0.4)
  Top 0.4: v6.6,26.5 4.9,24.8 4.9,21.4 4.8,21.3 4.8,12.7 5.4,12.1 5.4,10.6 5.1,10.3 5.1,8.7 6.9,6.9 11.1,6.9 14,9.8 v14,12.1
  Bottom 0.3: U9.1 14.24,11.96 v14,12.1
  Bottom 0.4: v6.6,26.5 U$20.P$1 6.6,23.5 C14.1
N$21
  Bottom 0.2: 28.05,27 25.7,27 24.7,26 23.2,26 22.25,25.05 U$21.29 | 28.05,27 R32.2 | R34.1 28.75,26.3 28.05,27
N$22
  Bottom 0.2: U$21.8 25.95,20.25 26.1,20.1 28.4,20.1 29.68,21.34 29.68,21.35 U$1.P$1
N$29
  Bottom 0.2: INA210.4 1.95,16.55 2.2,16.3 2.2,15.75 R19.2 | U$2.3 2.45,11.55 2.3,11.7 2.3,11.1 2.35,11.05 U$2.2
  Bottom 0.25: 2.3,11.7 2.3,12.4 2.1,12.6 1.25,12.6 C9.1
  Bottom 0.4: R19.2 1.65,14.35 1.2,13.9 C9.1
N$30
  Bottom 0.2: R15.2 0.8,8.3 1.1,8.6 2.7,8.6 2.8,8.7 2.8,9.9 2.7,10 2.5,10 2.3,10.2 2.3,10.4 2.45,10.55 U$2.1
N$31
  Bottom 0.2: R16.2 2.95,7.95 3.3,8.3 3.3,8.8 3.75,9.25 U$2.16
N$32
  Bottom 0.2: U$2.12 7,10.55 R17.2
N$33  (via drill 0.4)
  Top 0.2: v35.1,25.2 34.2,26.1 34.2,27.7 33,28.9 33,29.9 v34.4,31.3
  Bottom 0.2: R33.2 27.45,25.45 28.2,24.7 29.2,24.7 29.6,24.3 34.2,24.3 v35.1,25.2 | v34.4,31.3 37.6,34.5 U$24.ANODE
N$37  (via drill 0.4)
  Top 0.4: U$3.P$1 1.5,32.27 1.5,19.9 2.2,19.2 2.2,18.4 1.5,17.7 1.5,14.7 v2.5,13.7
  Bottom 0.2: INA210.5 2,17.2 2.6,16.6 2.6,15.95 R19.1 | R22.2 4.55,15.65 5.12,16.23 U$19.1
  Bottom 0.4: R22.2 R19.1 3.35,14.35 2.7,13.7 v2.5,13.7
N$39
  Bottom 0.2: INA210.1 3.15,17.85 2.9,18.1 2.9,18.5 2.7,18.7 R20.1 2.7,19.5 2.3,19.9 1.8,19.9 1.4,20.3 R21.2
N$43
  Bottom 0.2: STWD100.3 10.28,16.5 10.9,16.5 11.36,16.96 | 11.36,16.96 SJ1.2 | R24.2 10.45,18.85 10.45,18.45 10.7,18.2 11,18.2 11.3,17.9 11.3,17.02 11.36,16.96
N$44
  Bottom 0.2: U9.2 14.9,11.9 15.2,12.2 15.85,12.2 R40.2
OPTO
  Bottom 0.2: U$21.1 24.65,23.75 25.3,24.4 25.9,24.4 26.15,24.15 R33.1 26.75,24.1
SCK  (via drill 0.4)
  Top 0.2: PQ60_HEADER.P$33 v28.5,39.2
  Bottom 0.2: v28.5,39.2 PQ60_RECEPTACLE.P$33
SCL  (via drill 0.4)
  Top 0.2: v32.1,26.8 29.2,26.8 28.8,26.4 26.6,26.4 25.2,25 23.8,25 22.9,24.1 19.9,24.1 19.4,23.6 18.6,23.6 17.9,24.3 v17.9,24.7 | v30.2,34.7 29.8,34.7 29.1,34 PQ60_HEADER.P$29 29.1,31.8
  Bottom 0.2: U$21.23 19.15,23.25 17.9,24.5 v17.9,24.7 | PQ60_RECEPTACLE.P$29 29.1,34 29.8,34.7 v30.2,34.7 30.6,34.3 30.6,30.7 32.1,29.2 v32.1,26.8
SDA  (via drill 0.4)
  Top 0.2: v19,24.5 22.6,24.5 23.5,25.4 25,25.4 26.4,26.8 28.6,26.8 29,27.2 30.6,27.2 30.9,27.5 v30.9,28.1 | v29.7,30.8 PQ60_HEADER.P$30
  Bottom 0.2: U$21.24 19.25,23.75 19,24 v19,24.5 | PQ60_RECEPTACLE.P$30 v29.7,30.8 30.9,29.6 v30.9,28.1
SHDN  (via drill 0.4)
  Top 0.2: v19.1,16.8 20.4,15.5 20.4,12.2 19.5,11.3 19.5,10.3 19.9,9.9 20.7,9.9 24.5,13.7 24.5,14.9 25.1,15.5 26,15.5 26.8,16.3 27.6,16.3 28,15.9 30.5,15.9 37.1,22.5 37.1,24.7 37.8,25.4 37.8,26.8 37.01,27.59 36.47,27.59 35.87,28.19 35.87,29.51 36.4,30.04 v36.4,34.5
  Bottom 0.2: 19.76,16.8 U$4.P$1 | U$10.P$1 19.76,16.8 | 19.76,16.8 v19.1,16.8 | U$24.COLLECTOR v36.4,34.5
SOL_ISEN  (via drill 0.4)
  Top 0.2: v21.2,14.1 21.2,11.7 v20.3,10.8
  Bottom 0.2: U$21.13 21.75,18.95 20.7,17.9 20.7,14.6 v21.2,14.1 | v20.3,10.8 20.95,10.8 R8.2
  Bottom 0.3: R8.2 21.3,11.05 U$18.3
SWDCLK  (via drill 0.4)
  Top 0.2: 40.9,28.5 v41,28.4 40.7,28.7 v36.9,28.7
  Bottom 0.2: U$21.30 22.75,24.95 23.4,25.6 24.9,25.6 25.9,26.6 27.7,26.6 28.8,25.5 29.6,25.5 30,25.1 33,25.1 34.7,26.8 34.7,28.1 35.3,28.7 v36.9,28.7 | v41,28.4 40.24,27.64 U$22.4
SWDIO
  Bottom 0.2: U$21.32 23.75,24.65 23.9,24.8 27.5,24.8 28,24.3 29,24.3 29.4,23.9 40,23.9 40.5,24.4 40.5,25.5 U$22.2
SWDRST
  Bottom 0.2: U$21.31 23.25,24.85 23.6,25.2 25.1,25.2 26.1,26.2 27.5,26.2 28.6,25.1 29.4,25.1 29.8,24.7 33.2,24.7 35.1,26.6 35.1,27.3 35.44,27.64 U$22.3
SYS
  Bottom 0.23: U$2.10 C10.1 7,11.05 U$2.11
  Bottom 0.4: C10.1 8.18,11.55 PWR.PIN2
SYS_RAW
  Bottom 0.2: SJ1.1 12.1,15.34
SYS_SW
  Bottom 0.2: STWD100.5 8.95,14.65 10.8,12.8 | U9.6 | 10.8,12.8 10.9,12.7 12,12.7 12.1,12.8 13.5,12.8 13.78,13.07 U$29.P$5 | 10.8,12.8 10.8,11.4 12.2,10 PWR.PIN1
  Bottom 0.4: PWR.PIN1 13.87,8.4 R28.2 U9.6
USB_DISCONNECT  (via drill 0.4)
  Top 0.2: v24.8,19.4 24.8,21.1 28.8,25.1 33,25.1 33.8,25.9 33.8,27.5 31.6,29.7 29.65,29.7 v29.63,29.68
  Bottom 0.2: U12.2 23.33,26.57 23.5,26.4 24.5,26.4 25.6,27.5 26.3,27.5 26.95,28.15 R30.1 28.1,28.3 29.48,29.68 v29.63,29.68 | U$21.9 23.75,19.25 23.9,19.1 24.5,19.1 v24.8,19.4
WDI  (via drill 0.4)
  Top 0.2: v24.7,18 24.3,18 23.9,17.6 23.9,16.5 24,16.4 24,15.8 23.5,15.3 23.5,14.8 23.3,14.6 22.8,14.6 20.36,17.04 20.36,17.54 19.7,18.2 16.5,18.2 15.4,19.3 15.4,19.7 15,20.1 14,20.1 13.6,19.7 13.6,16.5 v11.2,14.1
  Bottom 0.2: STWD100.4 10.25,14.55 10.7,14.1 v11.2,14.1 | 23.25,19.55 23.2,19.5 | 23.25,19.55 23.25,18.85 23.4,18.7 24,18.7 v24.7,18 | 23.25,19.55 U$21.10

### Text on the board
tPlace: PocketQube / EPS | Ver: 2.0 / Rev: C
tDocu: Copyright 2019 Satellite Applications Catapult | Cell | + | - | Designed and manufactured in the UK | Single cell lithium polymer | LiPo / Li-ion / 3.5-4.2V / 500mA max / charge rate | buildubo.co.uk | Power / jumper
bDocu: * | Sol in | jumper | Power